# EAGLE schematic SD1015_SD1525_sheet2 (EAGLE 9.6.2)

## Sheet 1 of 9
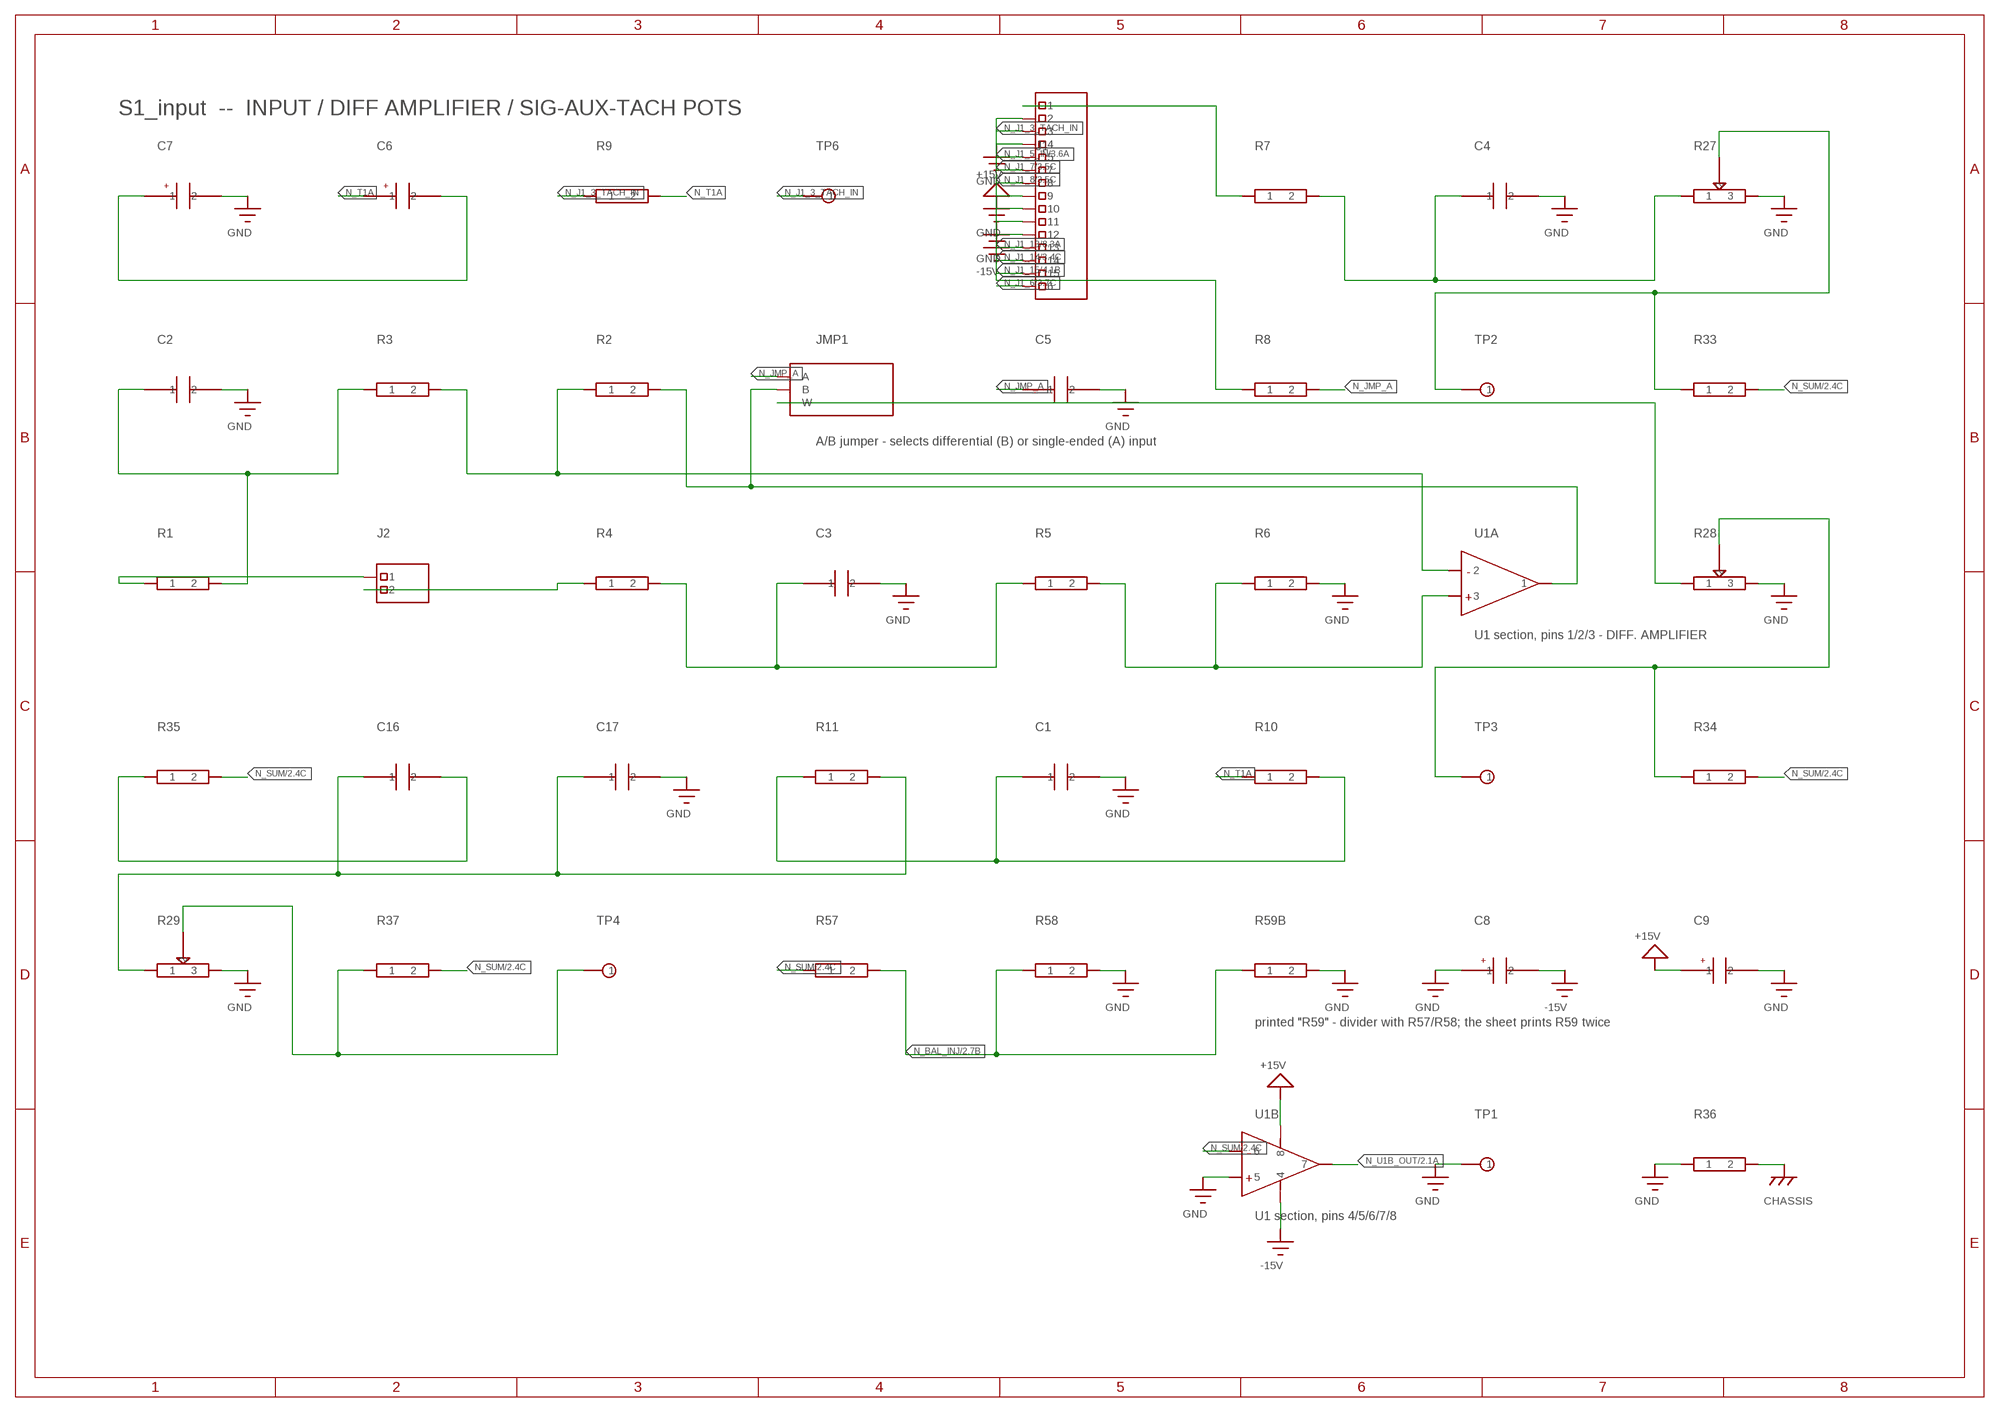
[diagram p0: schematic, sheet 1]

### Parts
C1  DS_C_1  (no package)
C2  DS_C_1  (no package)
C3  DS_C_1  (no package)
C4  DS_C_1  (no package)
C5  DS_C_1  (no package)
C6  DS_CPOL_1  (no package)
C7  DS_CPOL_1  (no package)
C8  DS_CPOL_1  (no package)
C9  DS_CPOL_1  (no package)
C16  DS_C_1  (no package)
C17  DS_C_1  (no package)
J1  DS_CONN_1  (no package)
J2  DS_CONN_2  (no package)
JMP1  A/B jumper - selects differential (B) or single-ended (A) input  DS_JUMPER_1  (no package)
R1  DS_R_1  (no package)
R2  DS_R_1  (no package)
R3  DS_R_1  (no package)
R4  DS_R_1  (no package)
R5  DS_R_1  (no package)
R6  DS_R_1  (no package)
R7  DS_R_1  (no package)
R8  DS_R_1  (no package)
R9  DS_R_1  (no package)
R10  DS_R_1  (no package)
R11  DS_R_1  (no package)
R27  DS_POT_1  (no package)
R28  DS_POT_1  (no package)
R29  DS_POT_1  (no package)
R33  DS_R_1  (no package)
R34  DS_R_1  (no package)
R35  DS_R_1  (no package)
R36  DS_R_1  (no package)
R37  DS_R_1  (no package)
R57  DS_R_1  (no package)
R58  DS_R_1  (no package)
R59B  printed "R59" - divider with R57/R58; the sheet prints R59 twice  DS_R_1  (no package)
TP1  DS_TP_1  (no package)
TP2  DS_TP_1  (no package)
TP3  DS_TP_1  (no package)
TP4  DS_TP_1  (no package)
TP6  DS_TP_1  (no package)
U1A  U1 section, pins 1/2/3 - DIFF. AMPLIFIER  DS_OPAMP_1  (no package)
U1B  U1 section, pins 4/5/6/7/8  DS_OPAMP_2  (no package)

### Nets
CHASSIS: R36.2 ; supply symbol labelled SUPPLY_CHASSIS ; also sheet 9
GND: C1.2 C2.2 C3.2 C4.2 C5.2 C7.2 C8.1 C9.2 C17.2 J1.4 J1.9 J1.11 R6.2 R27.3 R28.3 R29.3 R36.1 R58.2 R59B.2 TP1.1 U1B.5 ; supply symbol labelled SUPPLY_GND ; also sheet 2,3,4,5,6,7,8
N15: C8.2 J1.12 U1B.4 ; supply symbol labelled SUPPLY_N15 ; also sheet 2,3,6,8
N_AUX: R27.2 R33.1 TP2.1
N_AUX_IN: C4.1 R7.2 R27.1
N_BAL_INJ: R57.2 R58.1 R59B.1 ; also sheet 2
N_C6_C7_MID: C6.2 C7.1
N_CT: C16.2 R35.1
N_DIFFOUT: JMP1.B R2.2 U1A.1
N_IN1: C2.1 R1.2 R3.1
N_IN2: C3.1 R4.2 R5.1
N_J1_1: J1.1 R7.1
N_J1_2: J1.2 R8.1
N_J1_3_TACH_IN: J1.3 R9.1 TP6.1
N_J1_5_IN: J1.5 ; also sheet 3
N_J1_6: J1.6 ; also sheet 3
N_J1_7: J1.7 ; also sheet 3
N_J1_8: J1.8 ; also sheet 3
N_J1_13: J1.13 ; also sheet 8
N_J1_14: J1.14 ; also sheet 3,4
N_J1_15: J1.15 ; also sheet 4
N_J2_1: J2.1 R1.1
N_J2_2: J2.2 R4.1
N_JMP_A: C5.1 JMP1.A R8.2
N_SIG: R28.2 R34.1 TP3.1
N_SIGTOP: JMP1.W R28.1
N_SUM: R33.2 R34.2 R35.2 R37.2 R57.1 U1B.6 ; also sheet 2
N_T1A: C6.1 R9.2 R10.1
N_T2A: C1.1 R10.2 R11.1
N_TACH: C16.1 C17.1 R11.2 R29.1
N_TACH_W: R29.2 R37.1 TP4.1
N_U1A_INV: R2.1 R3.2 U1A.2
N_U1A_NONINV: R5.2 R6.1 U1A.3
N_U1B_OUT: U1B.7 ; also sheet 2
P15: C9.1 J1.10 U1B.8 ; supply symbol labelled SUPPLY_P15 ; also sheet 2,3,4,5,6,7,8

### Notes on the sheet
- S1_input  --  INPUT / DIFF AMPLIFIER / SIG-AUX-TACH POTS

## Sheet 2 of 9
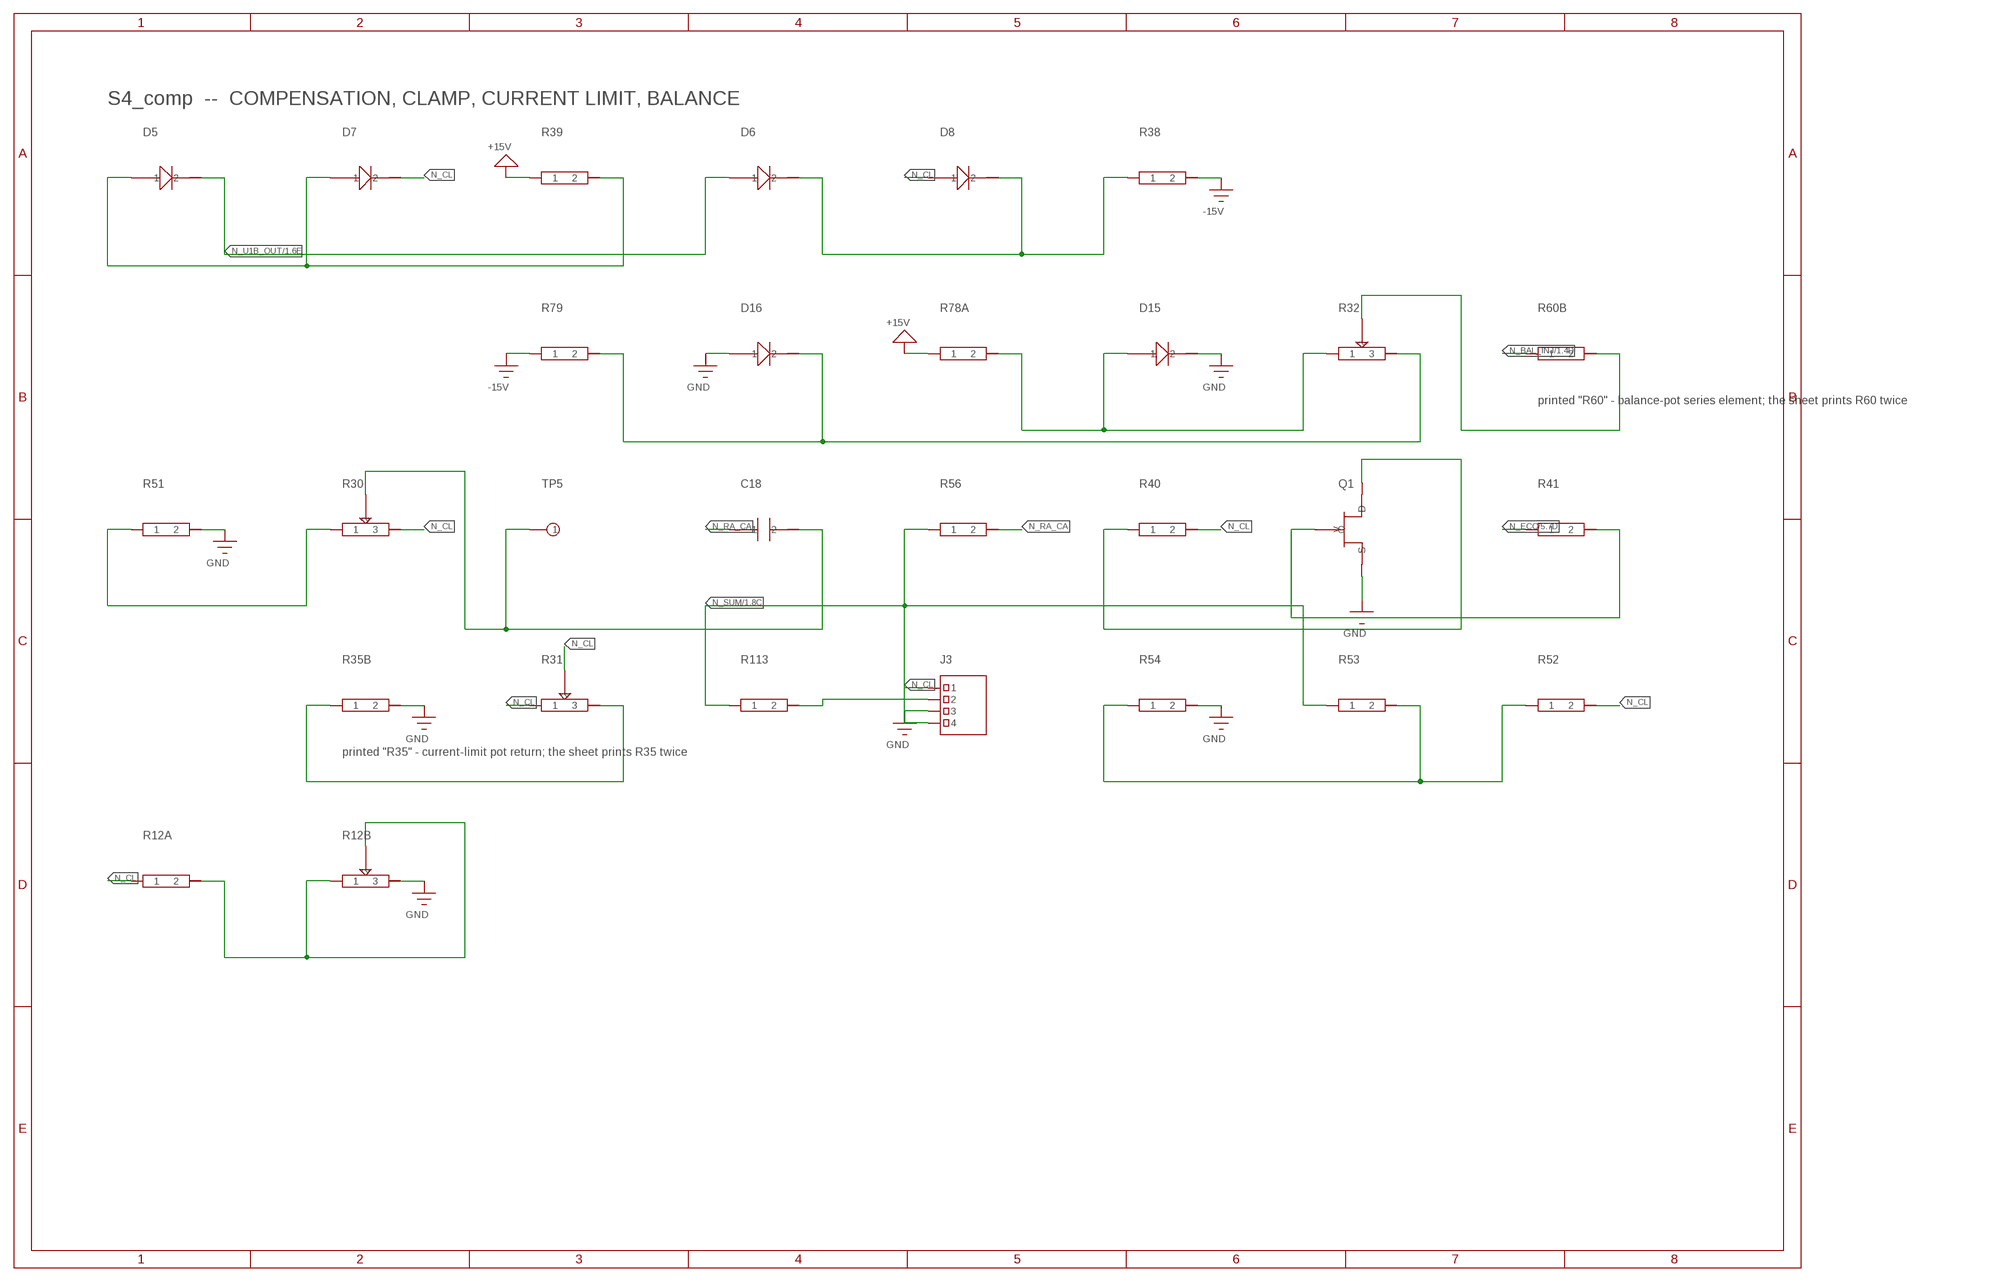
[diagram p1: schematic, sheet 2]

### Parts
C18  DS_C_1  (no package)
D5  DS_D_1  (no package)
D6  DS_D_1  (no package)
D7  DS_D_1  (no package)
D8  DS_D_1  (no package)
D15  DS_D_1  (no package)
D16  DS_D_1  (no package)
J3  DS_CONN_3  (no package)
Q1  DS_JFET_1  (no package)
R12A  DS_R_1  (no package)
R12B  DS_POT_2  (no package)
R30  DS_POT_3  (no package)
R31  DS_POT_1  (no package)
R32  DS_POT_3  (no package)
R35B  printed "R35" - current-limit pot return; the sheet prints R35 twice  DS_R_1  (no package)
R38  DS_R_1  (no package)
R39  DS_R_1  (no package)
R40  DS_R_1  (no package)
R41  DS_R_1  (no package)
R51  DS_R_1  (no package)
R52  DS_R_1  (no package)
R53  DS_R_1  (no package)
R54  DS_R_1  (no package)
R56  DS_R_1  (no package)
R60B  printed "R60" - balance-pot series element; the sheet prints R60 twice  DS_R_1  (no package)
R78A  DS_R_1  (no package)
R79  DS_R_1  (no package)
R113  DS_R_1  (no package)
TP5  DS_TP_1  (no package)

### Nets
GND: D15.2 D16.1 J3.3 Q1.S R12B.3 R35B.2 R51.2 R54.2 ; supply symbol labelled SUPPLY_GND ; also sheet 1,3,4,5,6,7,8
N15: R38.2 R79.1 ; supply symbol labelled SUPPLY_N15 ; also sheet 1,3,6,8
N_BAL_INJ: R60B.1 ; also sheet 1
N_BAL_N: D16.2 R32.3 R79.2
N_BAL_P: D15.1 R32.1 R78A.2
N_BAL_W: R32.2 R60B.2
N_CL: D7.2 D8.1 J3.1 R12A.1 R30.3 R31.1 R31.2 R40.2 R52.2
N_CLAMP_BOT: D6.2 D8.2 R38.1
N_CLAMP_TOP: D5.1 D7.1 R39.2
N_COMP_W: C18.2 R30.2 TP5.1
N_ECC: R41.1 ; also sheet 5,7
N_FB_DIV: R52.1 R53.2 R54.1
N_ILIM_BOT: R31.3 R35B.1
N_J3_2: J3.2 R113.2
N_PEAK_I: R12A.2 R12B.1 R12B.2
N_Q1_D: Q1.D R40.1
N_Q1_G: Q1.G R41.2
N_R30_TOP: R30.1 R51.1
N_RA_CA: C18.1 R56.2
N_SUM: J3.4 R53.1 R56.1 R113.1 ; also sheet 1
N_U1B_OUT: D5.2 D6.1 ; also sheet 1
P15: R39.1 R78A.1 ; supply symbol labelled SUPPLY_P15 ; also sheet 1,3,4,5,6,7,8

### Notes on the sheet
- S4_comp  --  COMPENSATION, CLAMP, CURRENT LIMIT, BALANCE

## Sheet 3 of 9
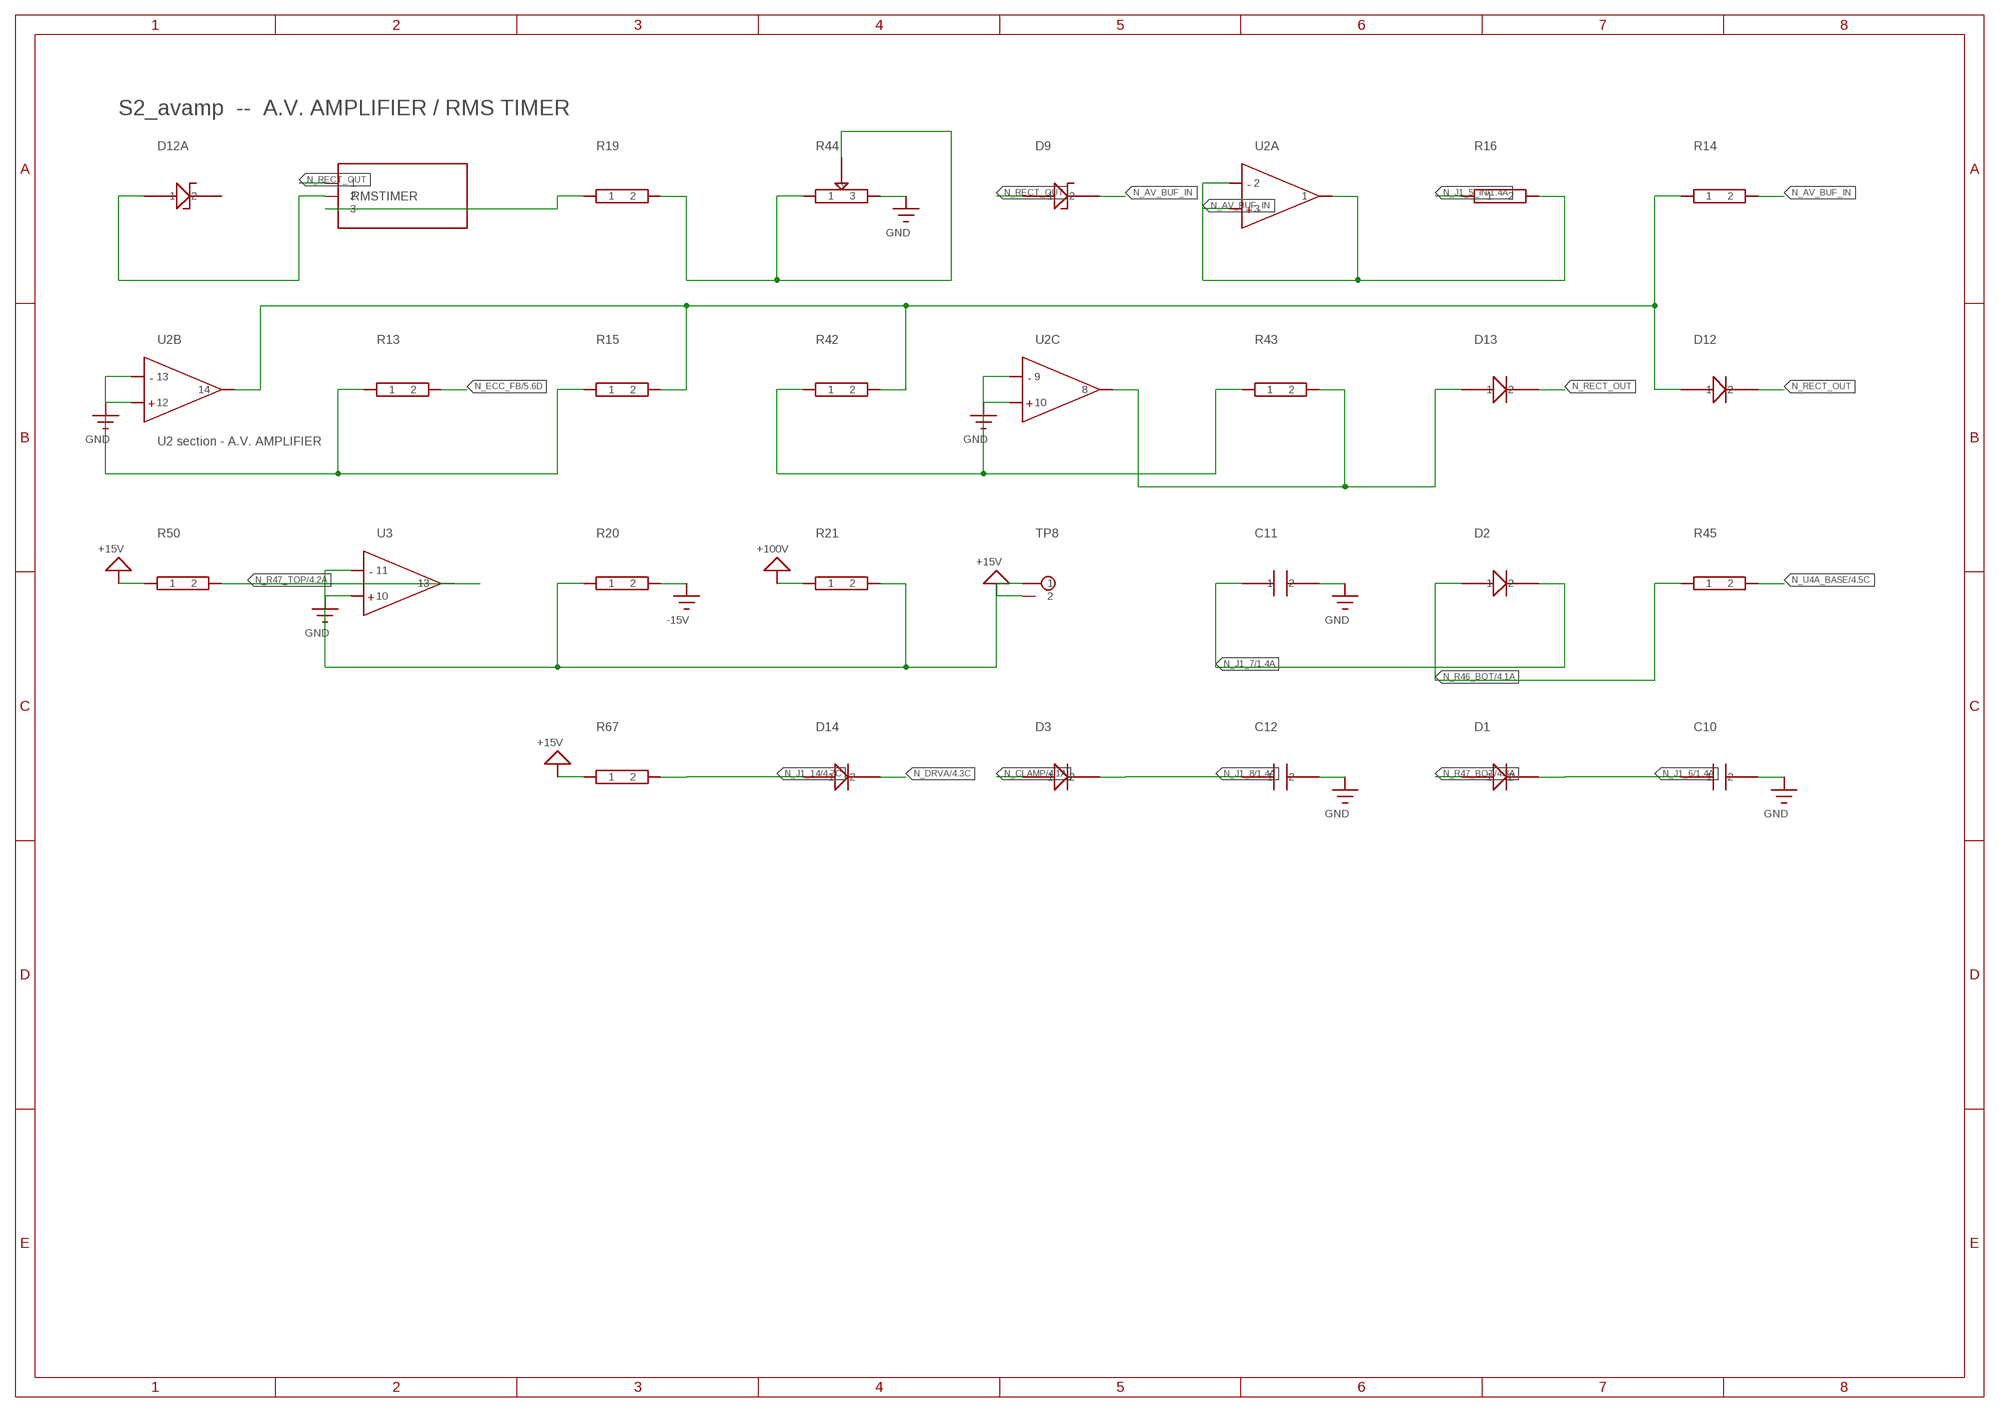
[diagram p2: schematic, sheet 3]

### Parts
C10  DS_C_1  (no package)
C11  DS_C_1  (no package)
C12  DS_C_1  (no package)
D1  DS_D_1  (no package)
D2  DS_D_1  (no package)
D3  DS_D_1  (no package)
D9  DS_ZENER_1  (no package)
D12  DS_D_1  (no package)
D12A  DS_ZENER_1  (no package)
D13  DS_D_1  (no package)
D14  DS_D_1  (no package)
R13  DS_R_1  (no package)
R14  DS_R_1  (no package)
R15  DS_R_1  (no package)
R16  DS_R_1  (no package)
R19  DS_R_1  (no package)
R20  DS_R_1  (no package)
R21  DS_R_1  (no package)
R42  DS_R_1  (no package)
R43  DS_R_1  (no package)
R44  DS_POT_2  (no package)
R45  DS_R_1  (no package)
R50  DS_R_1  (no package)
R67  DS_R_1  (no package)
RMSTIMER  DS_BLOCK_1  (no package)
TP8  DS_TP_2  (no package)
U2A  DS_OPAMP_1  (no package)
U2B  U2 section - A.V. AMPLIFIER  DS_OPAMP_3  (no package)
U2C  DS_OPAMP_4  (no package)
U3  DS_COMP_1  (no package)

### Nets
GND: C10.2 C11.2 C12.2 R44.3 U2B.12 U2C.10 U3.10 ; supply symbol labelled SUPPLY_GND ; also sheet 1,2,4,5,6,7,8
N15: R20.2 ; supply symbol labelled SUPPLY_N15 ; also sheet 1,2,6,8
N_AV_BUF_IN: D9.2 R14.2 U2A.3
N_AV_OUT: D12.1 R14.1 R15.2 R42.2 U2B.14
N_CLAMP: D3.1 ; also sheet 4
N_DRVA: D14.2 ; also sheet 4
N_ECC_FB: R13.2 ; also sheet 5
N_J1_5_IN: R16.1 ; also sheet 1
N_J1_6: C10.1 D1.2 ; also sheet 1
N_J1_7: C11.1 D2.2 ; also sheet 1
N_J1_8: C12.1 D3.2 ; also sheet 1
N_J1_14: D14.1 R67.2 ; also sheet 1,4
N_R46_BOT: D2.1 R45.1 ; also sheet 4
N_R47_BOT: D1.1 ; also sheet 4
N_R47_TOP: R50.2 U3.13 ; also sheet 4
N_RECT_OUT: D9.1 D12.2 D13.2 RMSTIMER.1
N_RMS_LEVEL: R19.2 R44.1 R44.2
N_RMS_OUT: R19.1 RMSTIMER.3
N_RMS_TOP: D12A.1 RMSTIMER.2
N_U2A_OUT: R16.2 U2A.1 U2A.2
N_U2B_INV: R13.1 R15.1 U2B.13
N_U2C_INV: R42.1 R43.1 U2C.9
N_U2C_OUT: D13.1 R43.2 U2C.8
N_U3_INV: R20.1 R21.2 TP8.1 U3.11
N_U4A_BASE: R45.2 ; also sheet 4
P15: R50.1 R67.1 TP8.2 ; supply symbol labelled SUPPLY_P15 ; also sheet 1,2,4,5,6,7,8
P100: R21.1 ; supply symbol labelled SUPPLY_P100 ; also sheet 6
Unconnected: D12A.2

### Notes on the sheet
- S2_avamp  --  A.V. AMPLIFIER / RMS TIMER

## Sheet 4 of 9
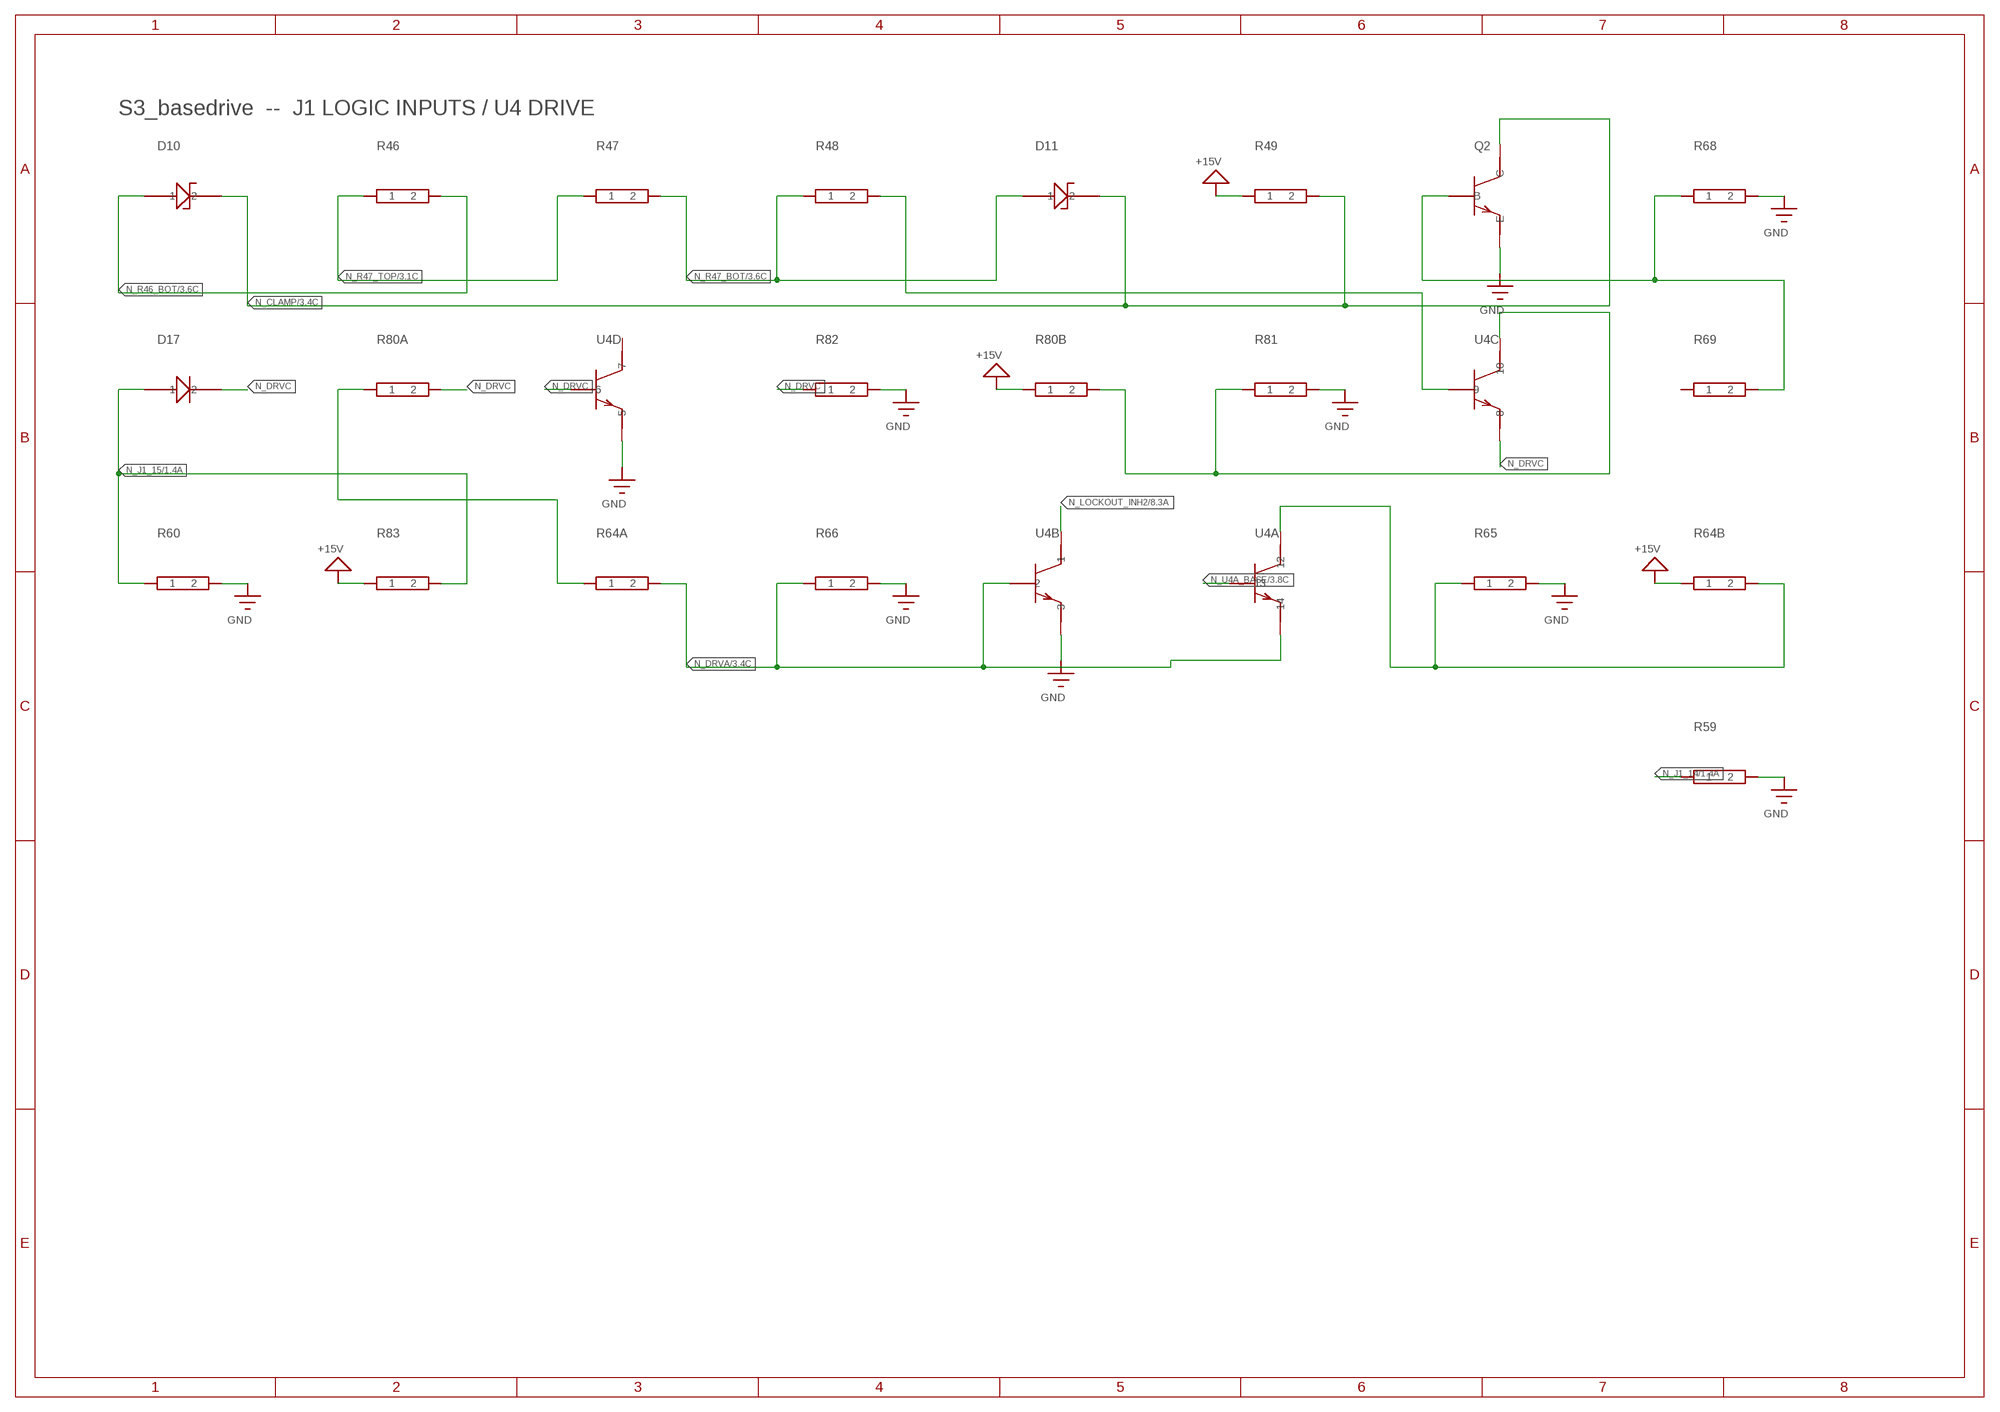
[diagram p3: schematic, sheet 4]

### Parts
D10  DS_ZENER_1  (no package)
D11  DS_ZENER_1  (no package)
D17  DS_D_1  (no package)
Q2  DS_NPN_1  (no package)
R46  DS_R_1  (no package)
R47  DS_R_1  (no package)
R48  DS_R_1  (no package)
R49  DS_R_1  (no package)
R59  DS_R_1  (no package)
R60  DS_R_1  (no package)
R64A  DS_R_1  (no package)
R64B  DS_R_1  (no package)
R65  DS_R_1  (no package)
R66  DS_R_1  (no package)
R68  DS_R_1  (no package)
R69  DS_R_1  (no package)
R80A  DS_R_1  (no package)
R80B  DS_R_1  (no package)
R81  DS_R_1  (no package)
R82  DS_R_1  (no package)
R83  DS_R_1  (no package)
U4A  DS_NPN_2  (no package)
U4B  DS_NPN_3  (no package)
U4C  DS_NPN_4  (no package)
U4D  DS_NPN_5  (no package)

### Nets
GND: Q2.E R59.2 R60.2 R65.2 R66.2 R68.2 R81.2 R82.2 U4B.3 U4D.5 ; supply symbol labelled SUPPLY_GND ; also sheet 1,2,3,5,6,7,8
N_CLAMP: D10.2 D11.2 Q2.C R49.2 ; also sheet 3
N_DRVA: R64A.2 R66.1 U4A.14 U4B.2 ; also sheet 3
N_DRVC: D17.2 R80A.2 R82.1 U4C.8 U4D.6
N_J1_14: R59.1 ; also sheet 1,3
N_J1_15: D17.1 R60.1 R83.2 ; also sheet 1
N_LOCKOUT_INH2: U4B.1 ; also sheet 8
N_Q2_BASE: Q2.B R68.1 R69.2
N_R46_BOT: D10.1 R46.2 ; also sheet 3
N_R47_BOT: D11.1 R47.2 R48.1 ; also sheet 3
N_R47_TOP: R46.1 R47.1 ; also sheet 3
N_R64A_R80A_TOP: R64A.1 R80A.1
N_U4A_BASE: U4A.13 ; also sheet 3
N_U4A_COL: R64B.2 R65.1 U4A.12
N_U4C_BASE: R48.2 U4C.9
N_U4C_COL: R80B.2 R81.1 U4C.10
P15: R49.1 R64B.1 R80B.1 R83.1 ; supply symbol labelled SUPPLY_P15 ; also sheet 1,2,3,5,6,7,8
Unconnected: R69.1 U4D.7

### Notes on the sheet
- S3_basedrive  --  J1 LOGIC INPUTS / U4 DRIVE

## Sheet 5 of 9
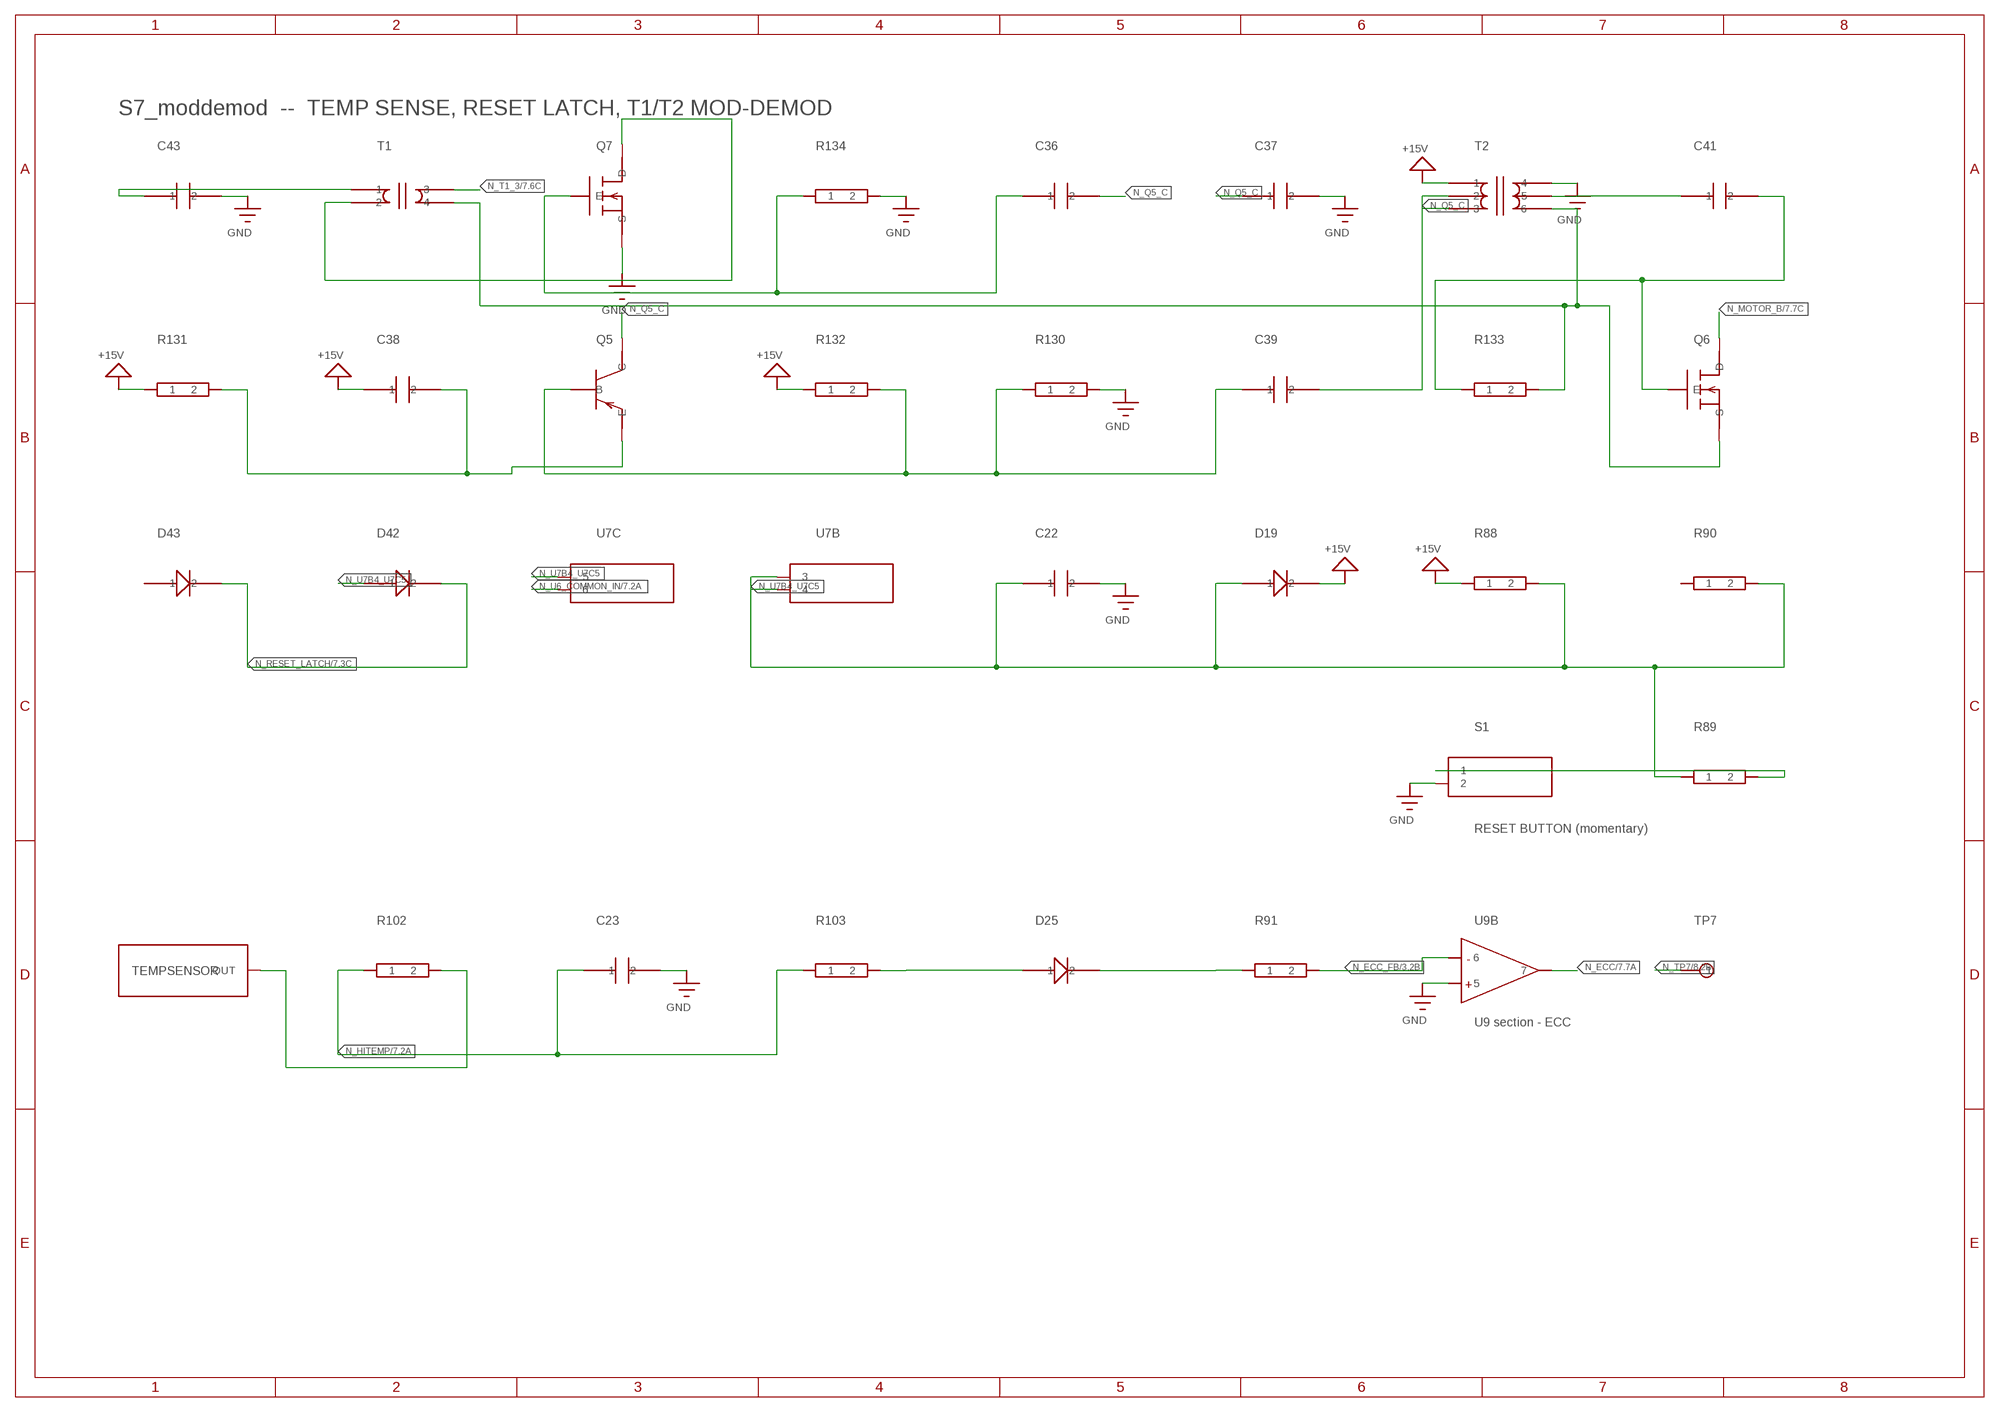
[diagram p4: schematic, sheet 5]

### Parts
C22  DS_C_1  (no package)
C23  DS_C_1  (no package)
C36  DS_C_1  (no package)
C37  DS_C_1  (no package)
C38  DS_C_1  (no package)
C39  DS_C_1  (no package)
C41  DS_C_1  (no package)
C43  DS_C_1  (no package)
D19  DS_D_1  (no package)
D25  DS_D_1  (no package)
D42  DS_D_1  (no package)
D43  DS_D_1  (no package)
Q5  DS_PNP_1  (no package)
Q6  DS_NMOS_1  (no package)
Q7  DS_NMOS_1  (no package)
R88  DS_R_1  (no package)
R89  DS_R_1  (no package)
R90  DS_R_1  (no package)
R91  DS_R_1  (no package)
R102  DS_R_1  (no package)
R103  DS_R_1  (no package)
R130  DS_R_1  (no package)
R131  DS_R_1  (no package)
R132  DS_R_1  (no package)
R133  DS_R_1  (no package)
R134  DS_R_1  (no package)
S1  RESET BUTTON (momentary)  DS_JUMPER_2  (no package)
T1  DS_XFMR_1  (no package)
T2  DS_XFMR_2  (no package)
TEMPSENSOR  DS_BLOCK_2  (no package)
TP7  DS_TP_1  (no package)
U7B  DS_IC_5  (no package)
U7C  DS_IC_6  (no package)
U9B  U9 section - ECC  DS_OPAMP_5  (no package)

### Nets
GND: C22.2 C23.2 C37.2 C43.2 Q7.S R130.2 R134.2 S1.2 T2.4 U9B.5 ; supply symbol labelled SUPPLY_GND ; also sheet 1,2,3,4,6,7,8
N_D25K: D25.2 R91.1
N_ECC: U9B.7 ; also sheet 2,7
N_ECC_FB: R91.2 U9B.6 ; also sheet 3
N_HITEMP: C23.1 R102.1 R103.1 ; also sheet 7
N_MODIN: C43.1 T1.1
N_MOTOR_B: Q6.D ; also sheet 7,9
N_Q5_B: C39.1 Q5.B R130.1 R132.2
N_Q5_C: C36.2 C37.1 Q5.C T2.3
N_Q5_E: C38.2 Q5.E R131.2
N_Q6_GATE: C41.2 Q6.E R133.1
N_Q7_GATE: C36.1 Q7.E R134.1
N_R103_D25: D25.1 R103.2
N_RESET_LATCH: D42.2 D43.2 ; also sheet 7
N_S1_R89: R89.2 S1.1
N_T1_2: Q7.D T1.2
N_T1_3: T1.3 ; also sheet 7
N_T1_4: Q6.S R133.2 T1.4 T2.6
N_T2_2: C39.2 T2.2
N_T2_5: C41.1 T2.5
N_TEMPSENS_OUT: R102.2 TEMPSENSOR.OUT
N_TEMPTRIP: C22.1 D19.1 R88.2 R89.1 R90.2 U7B.3
N_TP7: TP7.1 ; also sheet 8
N_U6_COMMON_IN: U7C.6 ; also sheet 7
N_U7B4_U7C5: D42.1 U7B.4 U7C.5
P15: C38.1 D19.2 R88.1 R131.1 R132.1 T2.1 ; supply symbol labelled SUPPLY_P15 ; also sheet 1,2,3,4,6,7,8
Unconnected: D43.1 R90.1

### Notes on the sheet
- S7_moddemod  --  TEMP SENSE, RESET LATCH, T1/T2 MOD-DEMOD

## Sheet 6 of 9
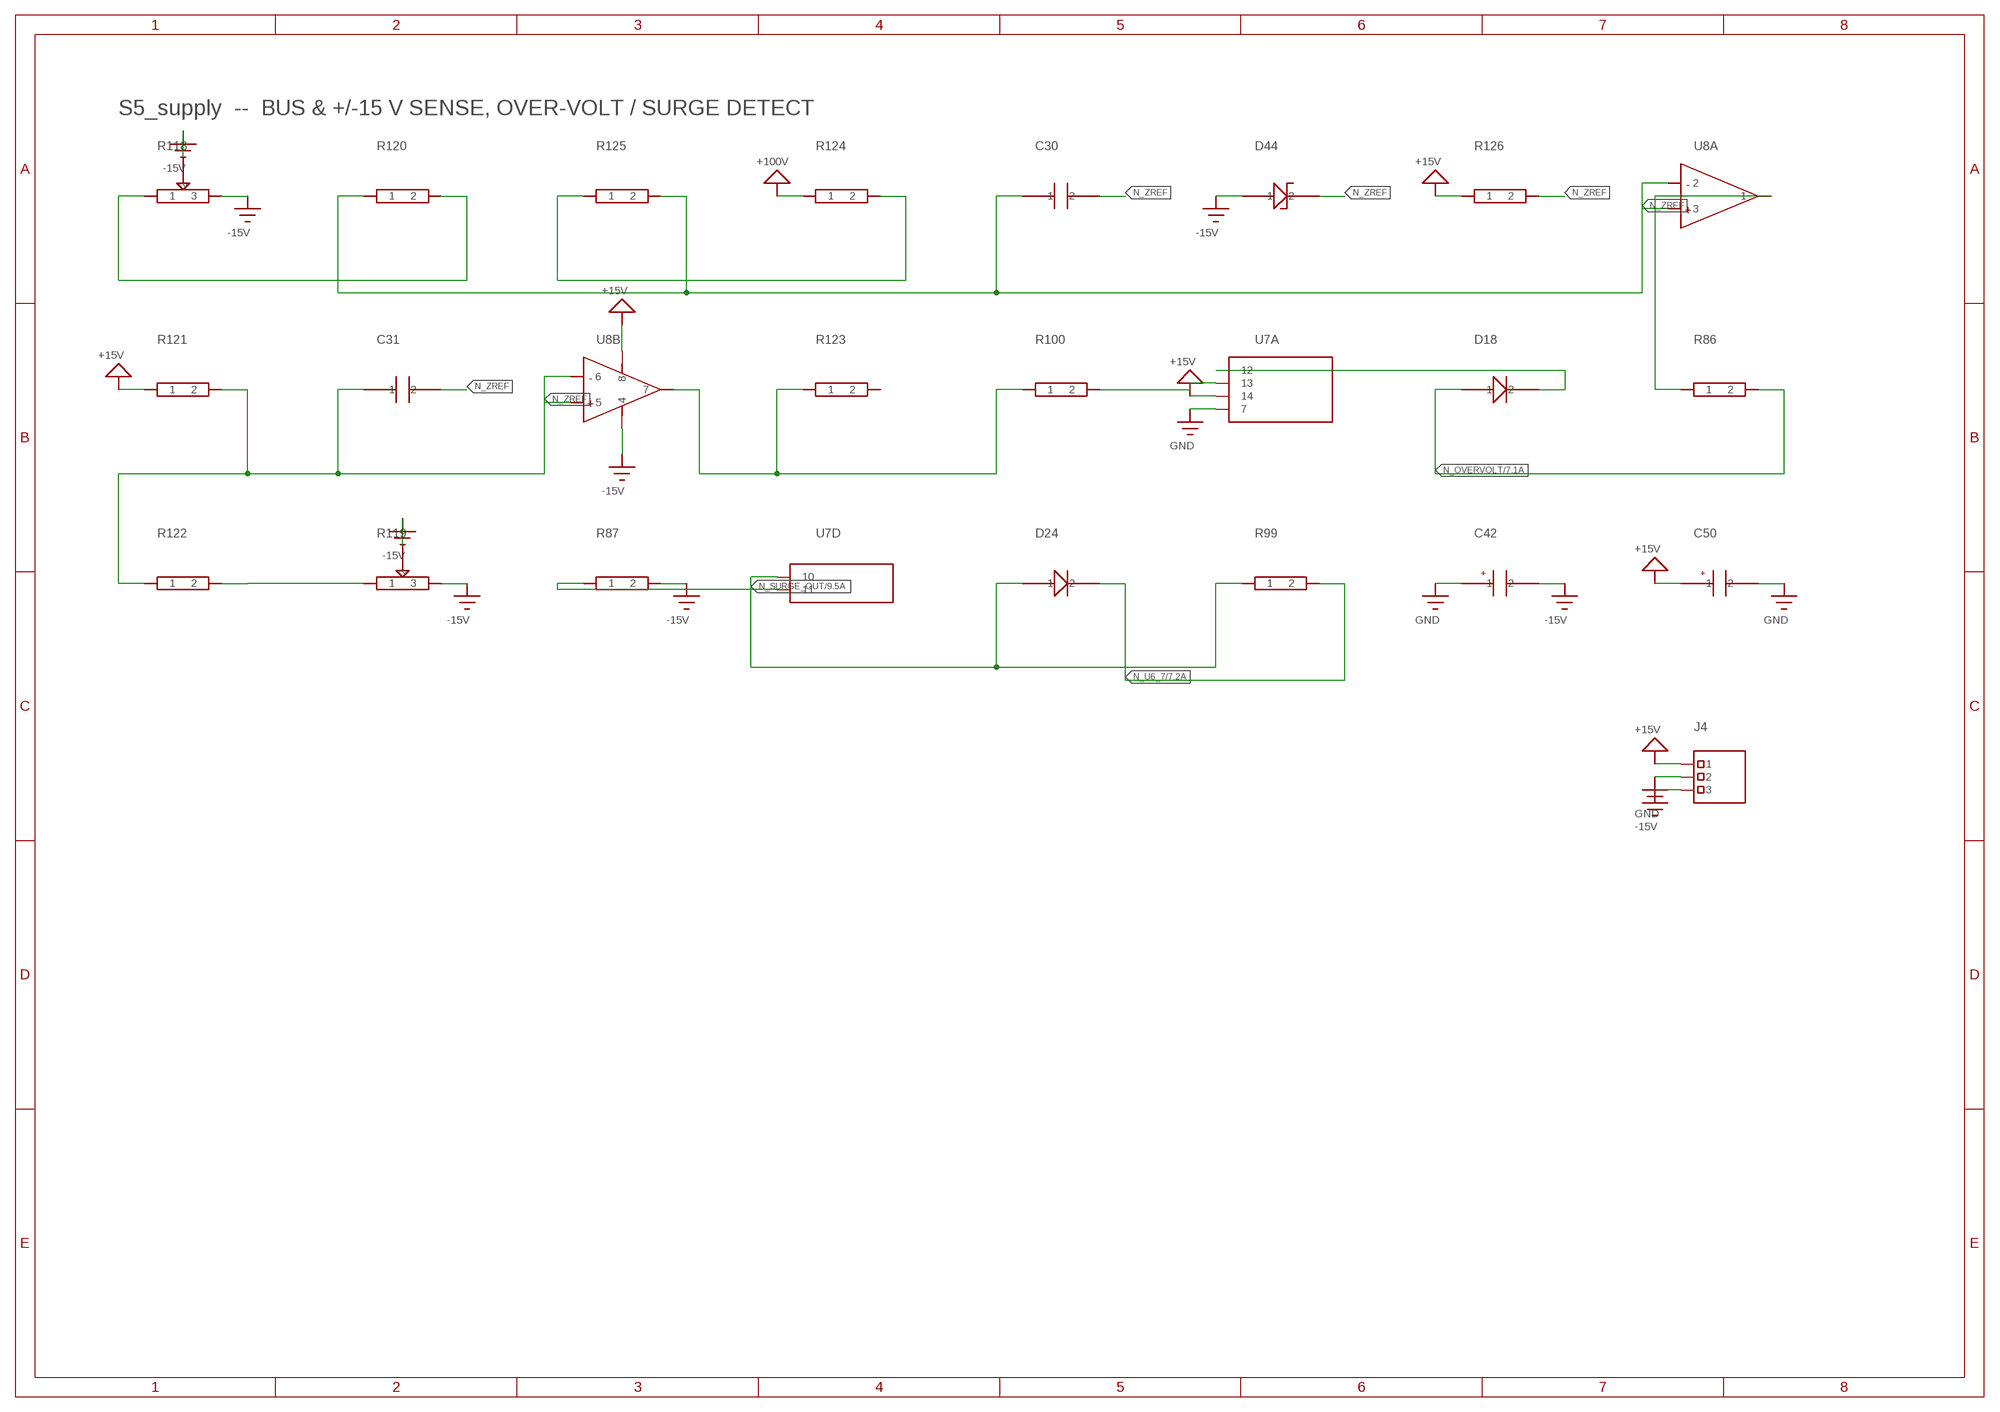
[diagram p5: schematic, sheet 6]

### Parts
C30  DS_C_1  (no package)
C31  DS_C_1  (no package)
C42  DS_CPOL_1  (no package)
C50  DS_CPOL_1  (no package)
D18  DS_D_1  (no package)
D24  DS_D_1  (no package)
D44  DS_ZENER_1  (no package)
J4  DS_CONN_4  (no package)
R86  DS_R_1  (no package)
R87  DS_R_1  (no package)
R99  DS_R_1  (no package)
R100  DS_R_1  (no package)
R118  DS_POT_4  (no package)
R119  DS_POT_4  (no package)
R120  DS_R_1  (no package)
R121  DS_R_1  (no package)
R122  DS_R_1  (no package)
R123  DS_R_1  (no package)
R124  DS_R_1  (no package)
R125  DS_R_1  (no package)
R126  DS_R_1  (no package)
U7A  DS_IC_1  (no package)
U7D  DS_IC_2  (no package)
U8A  DS_OPAMP_1  (no package)
U8B  DS_OPAMP_2  (no package)

### Nets
GND: C42.1 C50.2 J4.2 U7A.7 ; supply symbol labelled SUPPLY_GND ; also sheet 1,2,3,4,5,7,8
N15: C42.2 D44.1 J4.3 R87.2 R118.2 R118.3 R119.2 R119.3 U8B.4 ; supply symbol labelled SUPPLY_N15 ; also sheet 1,2,3,8
N_15VADJ: R119.1 R122.2
N_15VSENSE: C31.1 R121.2 R122.1 U8B.6
N_BUSSENSE: C30.1 R120.1 R125.2 U8A.2
N_HIBUSADJ: R118.1 R120.2
N_OVERVOLT: D18.1 R86.2 ; also sheet 7
N_R124_R125: R124.2 R125.1
N_SURGE_OUT: R87.1 U7D.11 ; also sheet 9
N_U6_7: D24.2 R99.2 ; also sheet 7
N_U7A_IN: R100.2 U7A.13
N_U7A_OUT: D18.2 U7A.12
N_U7D_OUT: D24.1 R99.1 U7D.10
N_U8A_OUT: R86.1 U8A.1
N_U8B_OUT: R100.1 R123.1 U8B.7
N_ZREF: C30.2 C31.2 D44.2 R126.2 U8A.3 U8B.5
P15: C50.1 J4.1 R121.1 R126.1 U7A.14 U8B.8 ; supply symbol labelled SUPPLY_P15 ; also sheet 1,2,3,4,5,7,8
P100: R124.1 ; supply symbol labelled SUPPLY_P100 ; also sheet 3
Unconnected: R123.2

### Notes on the sheet
- S5_supply  --  BUS & +/-15 V SENSE, OVER-VOLT / SURGE DETECT

## Sheet 7 of 9
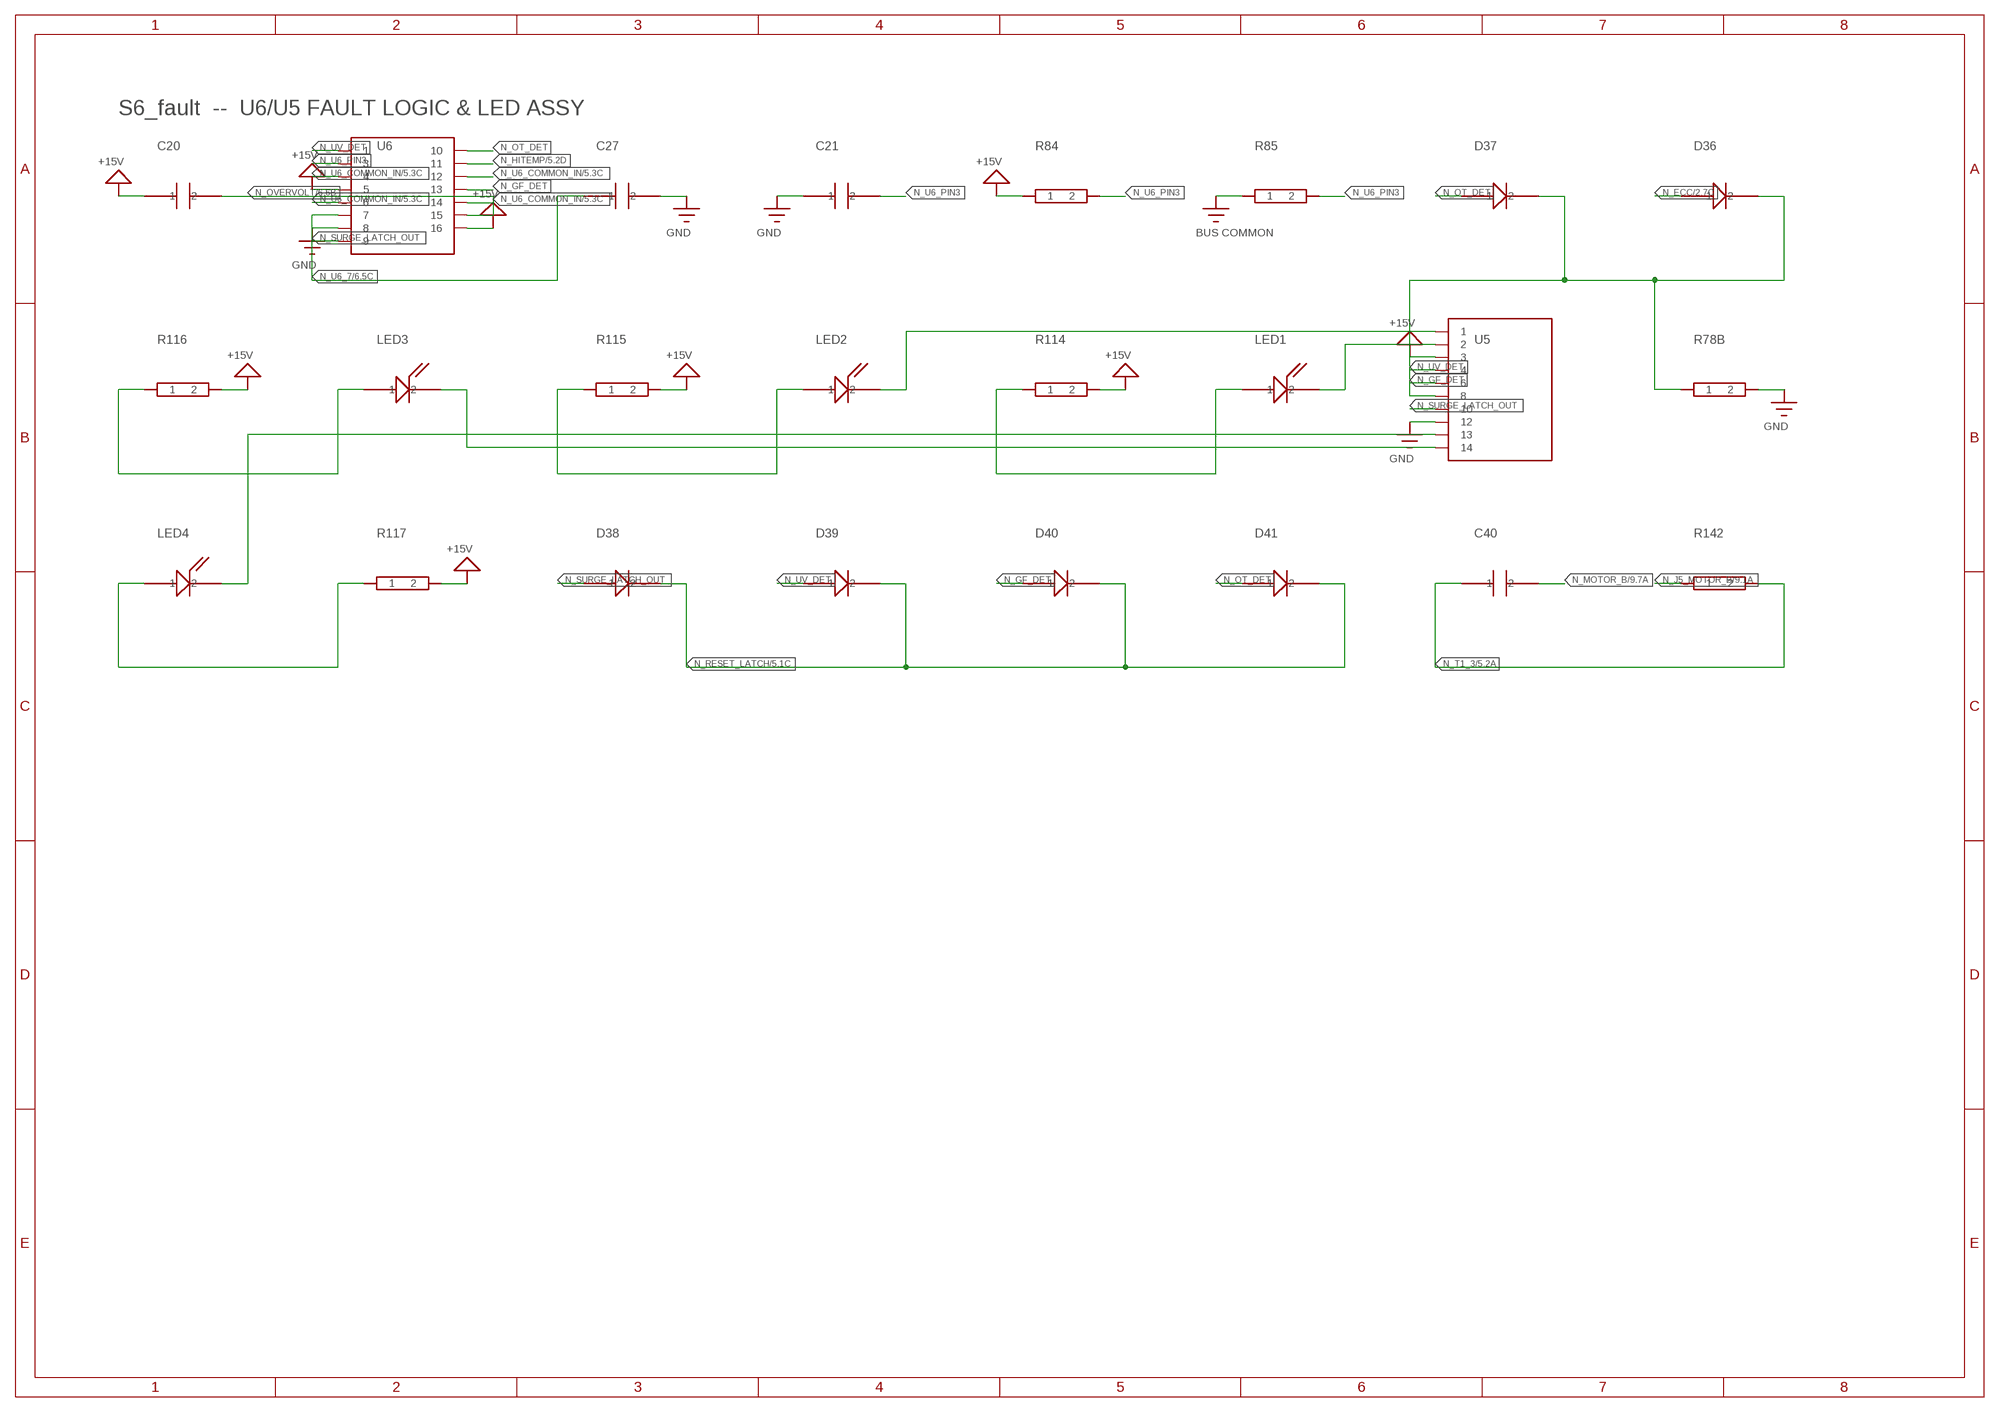
[diagram p6: schematic, sheet 7]

### Parts
C20  DS_C_1  (no package)
C21  DS_C_1  (no package)
C27  DS_C_1  (no package)
C40  DS_C_1  (no package)
D36  DS_D_1  (no package)
D37  DS_D_1  (no package)
D38  DS_D_1  (no package)
D39  DS_D_1  (no package)
D40  DS_D_1  (no package)
D41  DS_D_1  (no package)
LED1  DS_LED_1  (no package)
LED2  DS_LED_1  (no package)
LED3  DS_LED_1  (no package)
LED4  DS_LED_1  (no package)
R78B  DS_R_1  (no package)
R84  DS_R_1  (no package)
R85  DS_R_1  (no package)
R114  DS_R_1  (no package)
R115  DS_R_1  (no package)
R116  DS_R_1  (no package)
R117  DS_R_1  (no package)
R142  DS_R_1  (no package)
U5  DS_IC_4  (no package)
U6  DS_IC_3  (no package)

### Nets
BUSCOM: R85.1 ; supply symbol labelled SUPPLY_BUSCOM ; also sheet 9
GND: C21.1 C27.2 R78B.2 U5.12 U6.8 ; supply symbol labelled SUPPLY_GND ; also sheet 1,2,3,4,5,6,8
N_ECC: D36.1 ; also sheet 2,5
N_GF_DET: D40.1 U5.6 U6.13
N_HITEMP: U6.11 ; also sheet 5
N_J5_MOTOR_B: R142.1 ; also sheet 9
N_LED_GF: LED2.2 U5.1
N_LED_GF_A: LED2.1 R115.1
N_LED_OT: LED3.2 U5.14
N_LED_OT_A: LED3.1 R116.1
N_LED_SURGE: LED4.2 U5.13
N_LED_SURGE_A: LED4.1 R117.1
N_LED_UV: LED1.2 U5.2
N_LED_UV_A: LED1.1 R114.1
N_MOTOR_B: C40.2 ; also sheet 5,9
N_OT_DET: D37.1 D41.1 U6.10
N_OT_LATCH_OUT: D36.2 D37.2 R78B.1 U5.8
N_OVERVOLT: C20.2 U6.15 ; also sheet 6
N_RESET_LATCH: D38.2 D39.2 D40.2 D41.2 ; also sheet 5
N_SURGE_LATCH_OUT: D38.1 U5.10 U6.9
N_T1_3: C40.1 R142.2 ; also sheet 5
N_U6_7: C27.1 U6.7 ; also sheet 6
N_U6_COMMON_IN: U6.4 U6.6 U6.12 U6.14 ; also sheet 5
N_U6_PIN3: C21.2 R84.2 R85.2 U6.3
N_UV_DET: D39.1 U5.4 U6.1
P15: C20.1 R84.1 R114.2 R115.2 R116.2 R117.2 U5.3 U6.5 U6.16 ; supply symbol labelled SUPPLY_P15 ; also sheet 1,2,3,4,5,6,8

### Notes on the sheet
- S6_fault  --  U6/U5 FAULT LOGIC & LED ASSY

## Sheet 8 of 9
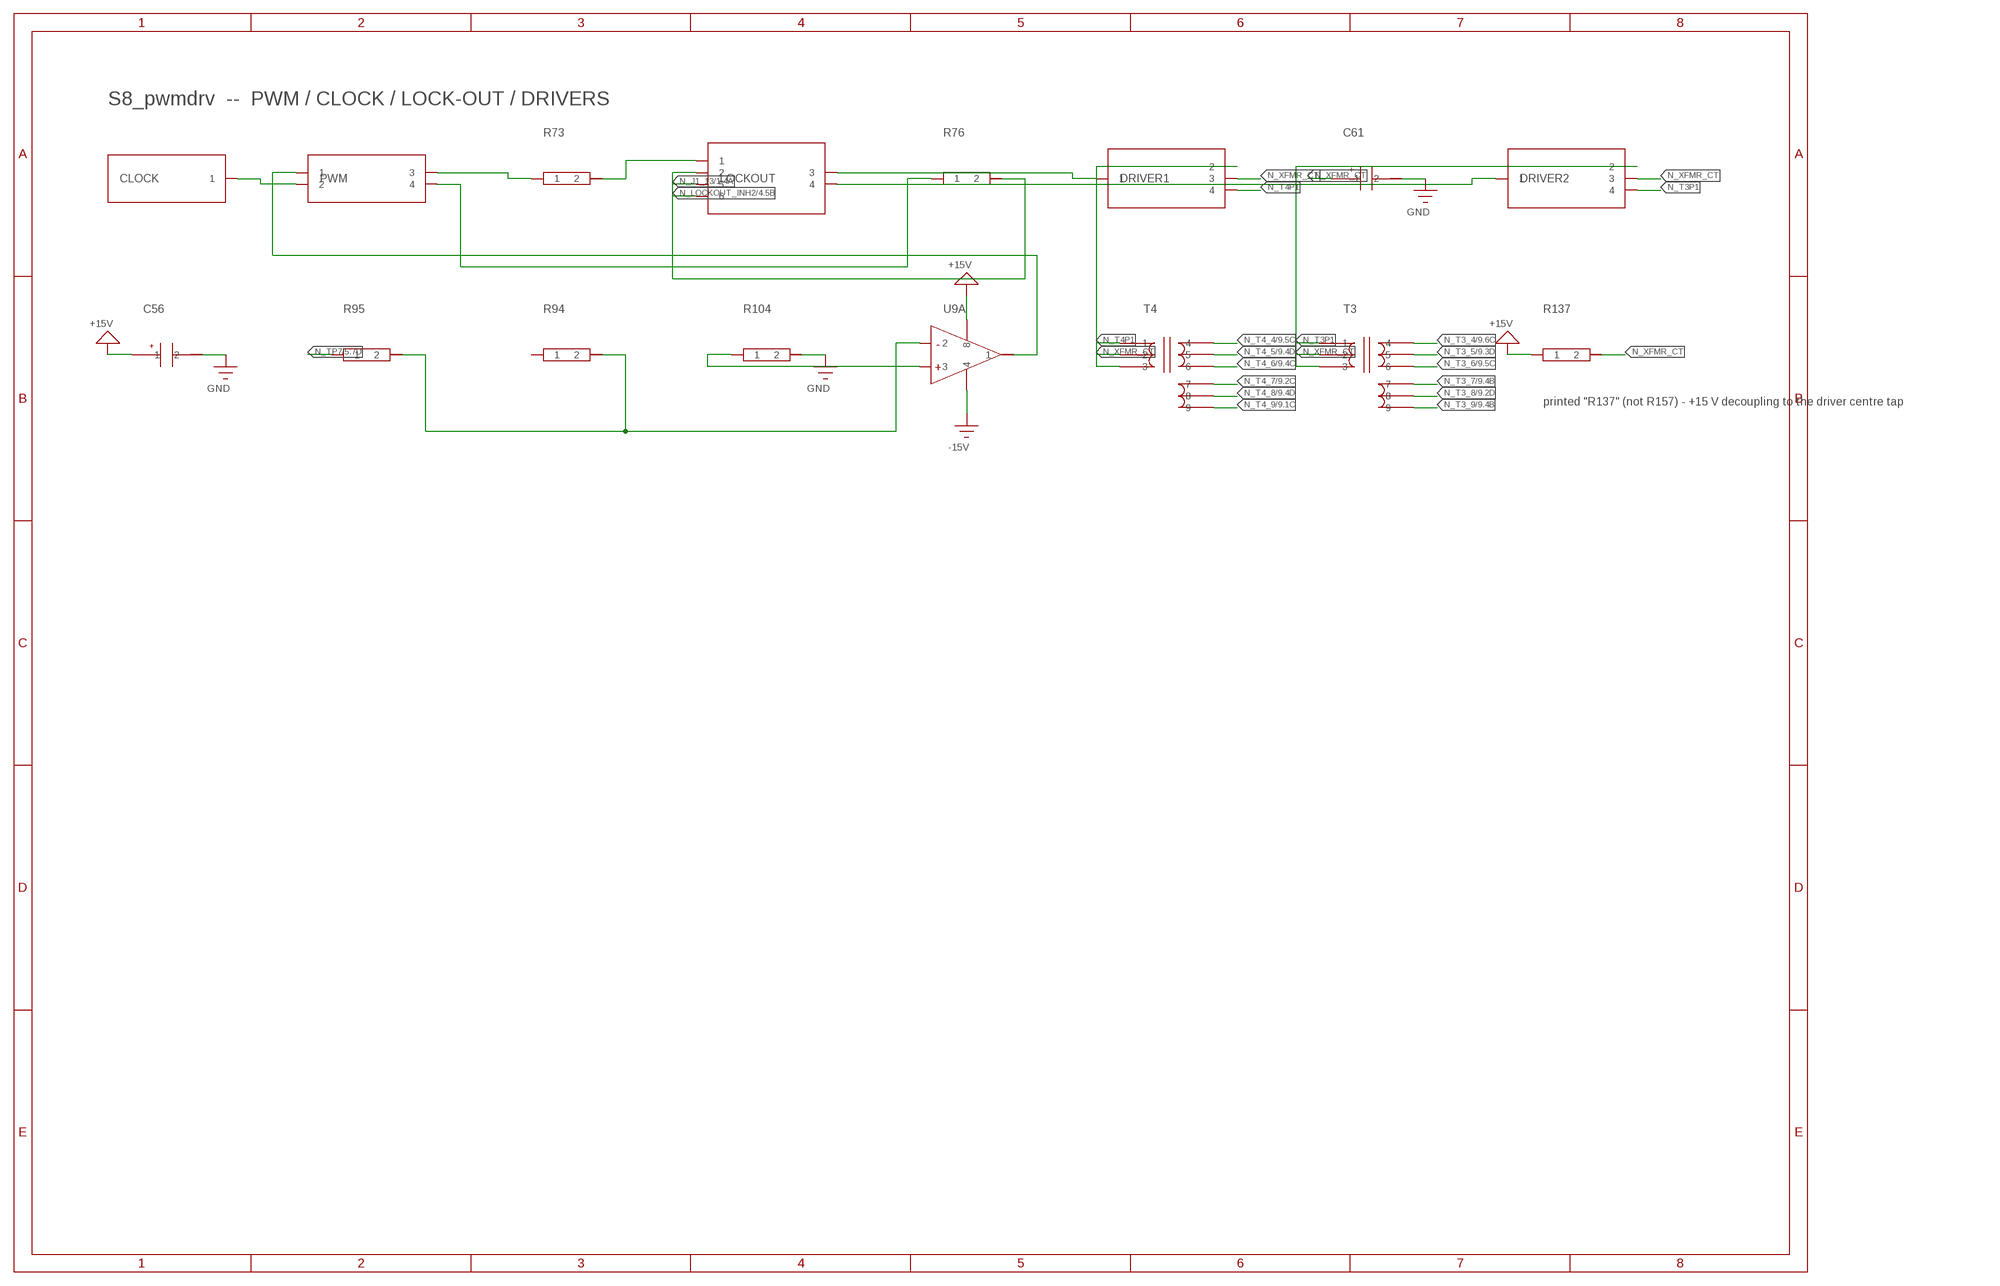
[diagram p7: schematic, sheet 8]

### Parts
C56  DS_CPOL_1  (no package)
C61  DS_CPOL_1  (no package)
CLOCK  DS_BLOCK_4  (no package)
DRIVER1  DS_BLOCK_6  (no package)
DRIVER2  DS_BLOCK_6  (no package)
LOCKOUT  DS_BLOCK_5  (no package)
PWM  DS_BLOCK_3  (no package)
R73  DS_R_1  (no package)
R76  DS_R_1  (no package)
R94  DS_R_1  (no package)
R95  DS_R_1  (no package)
R104  DS_R_1  (no package)
R137  printed "R137" (not R157) - +15 V decoupling to the driver centre tap  DS_R_1  (no package)
T3  DS_XFMR_3  (no package)
T4  DS_XFMR_3  (no package)
U9A  DS_OPAMP_6  (no package)

### Nets
GND: C56.2 C61.2 R104.2 ; supply symbol labelled SUPPLY_GND ; also sheet 1,2,3,4,5,6,7
N15: U9A.4 ; supply symbol labelled SUPPLY_N15 ; also sheet 1,2,3,6
N_CLK_OUT: CLOCK.1 PWM.2
N_J1_13: LOCKOUT.5 ; also sheet 1
N_LO_OUTA: DRIVER1.1 LOCKOUT.3
N_LO_OUTB: DRIVER2.1 LOCKOUT.4
N_LOCKOUT_INH2: LOCKOUT.6 ; also sheet 4
N_PWM_OUTA: PWM.3 R73.1
N_PWM_OUTB: PWM.4 R76.1
N_R73_LO: LOCKOUT.1 R73.2
N_R76_LO: LOCKOUT.2 R76.2
N_T3_4: T3.4 ; also sheet 9
N_T3_5: T3.5 ; also sheet 9
N_T3_6: T3.6 ; also sheet 9
N_T3_7: T3.7 ; also sheet 9
N_T3_8: T3.8 ; also sheet 9
N_T3_9: T3.9 ; also sheet 9
N_T3P1: DRIVER2.4 T3.1
N_T3P3: DRIVER2.2 T3.3
N_T4_4: T4.4 ; also sheet 9
N_T4_5: T4.5 ; also sheet 9
N_T4_6: T4.6 ; also sheet 9
N_T4_7: T4.7 ; also sheet 9
N_T4_8: T4.8 ; also sheet 9
N_T4_9: T4.9 ; also sheet 9
N_T4P1: DRIVER1.4 T4.1
N_T4P3: DRIVER1.2 T4.3
N_TP7: R95.1 ; also sheet 5
N_U9_NONINV: R104.1 U9A.3
N_U9_OUT: PWM.1 U9A.1
N_U9_SUM: R94.2 R95.2 U9A.2
N_XFMR_CT: C61.1 DRIVER1.3 DRIVER2.3 R137.2 T3.2 T4.2
P15: C56.1 R137.1 U9A.8 ; supply symbol labelled SUPPLY_P15 ; also sheet 1,2,3,4,5,6,7
Unconnected: R94.1

### Notes on the sheet
- S8_pwmdrv  --  PWM / CLOCK / LOCK-OUT / DRIVERS

## Sheet 9 of 9
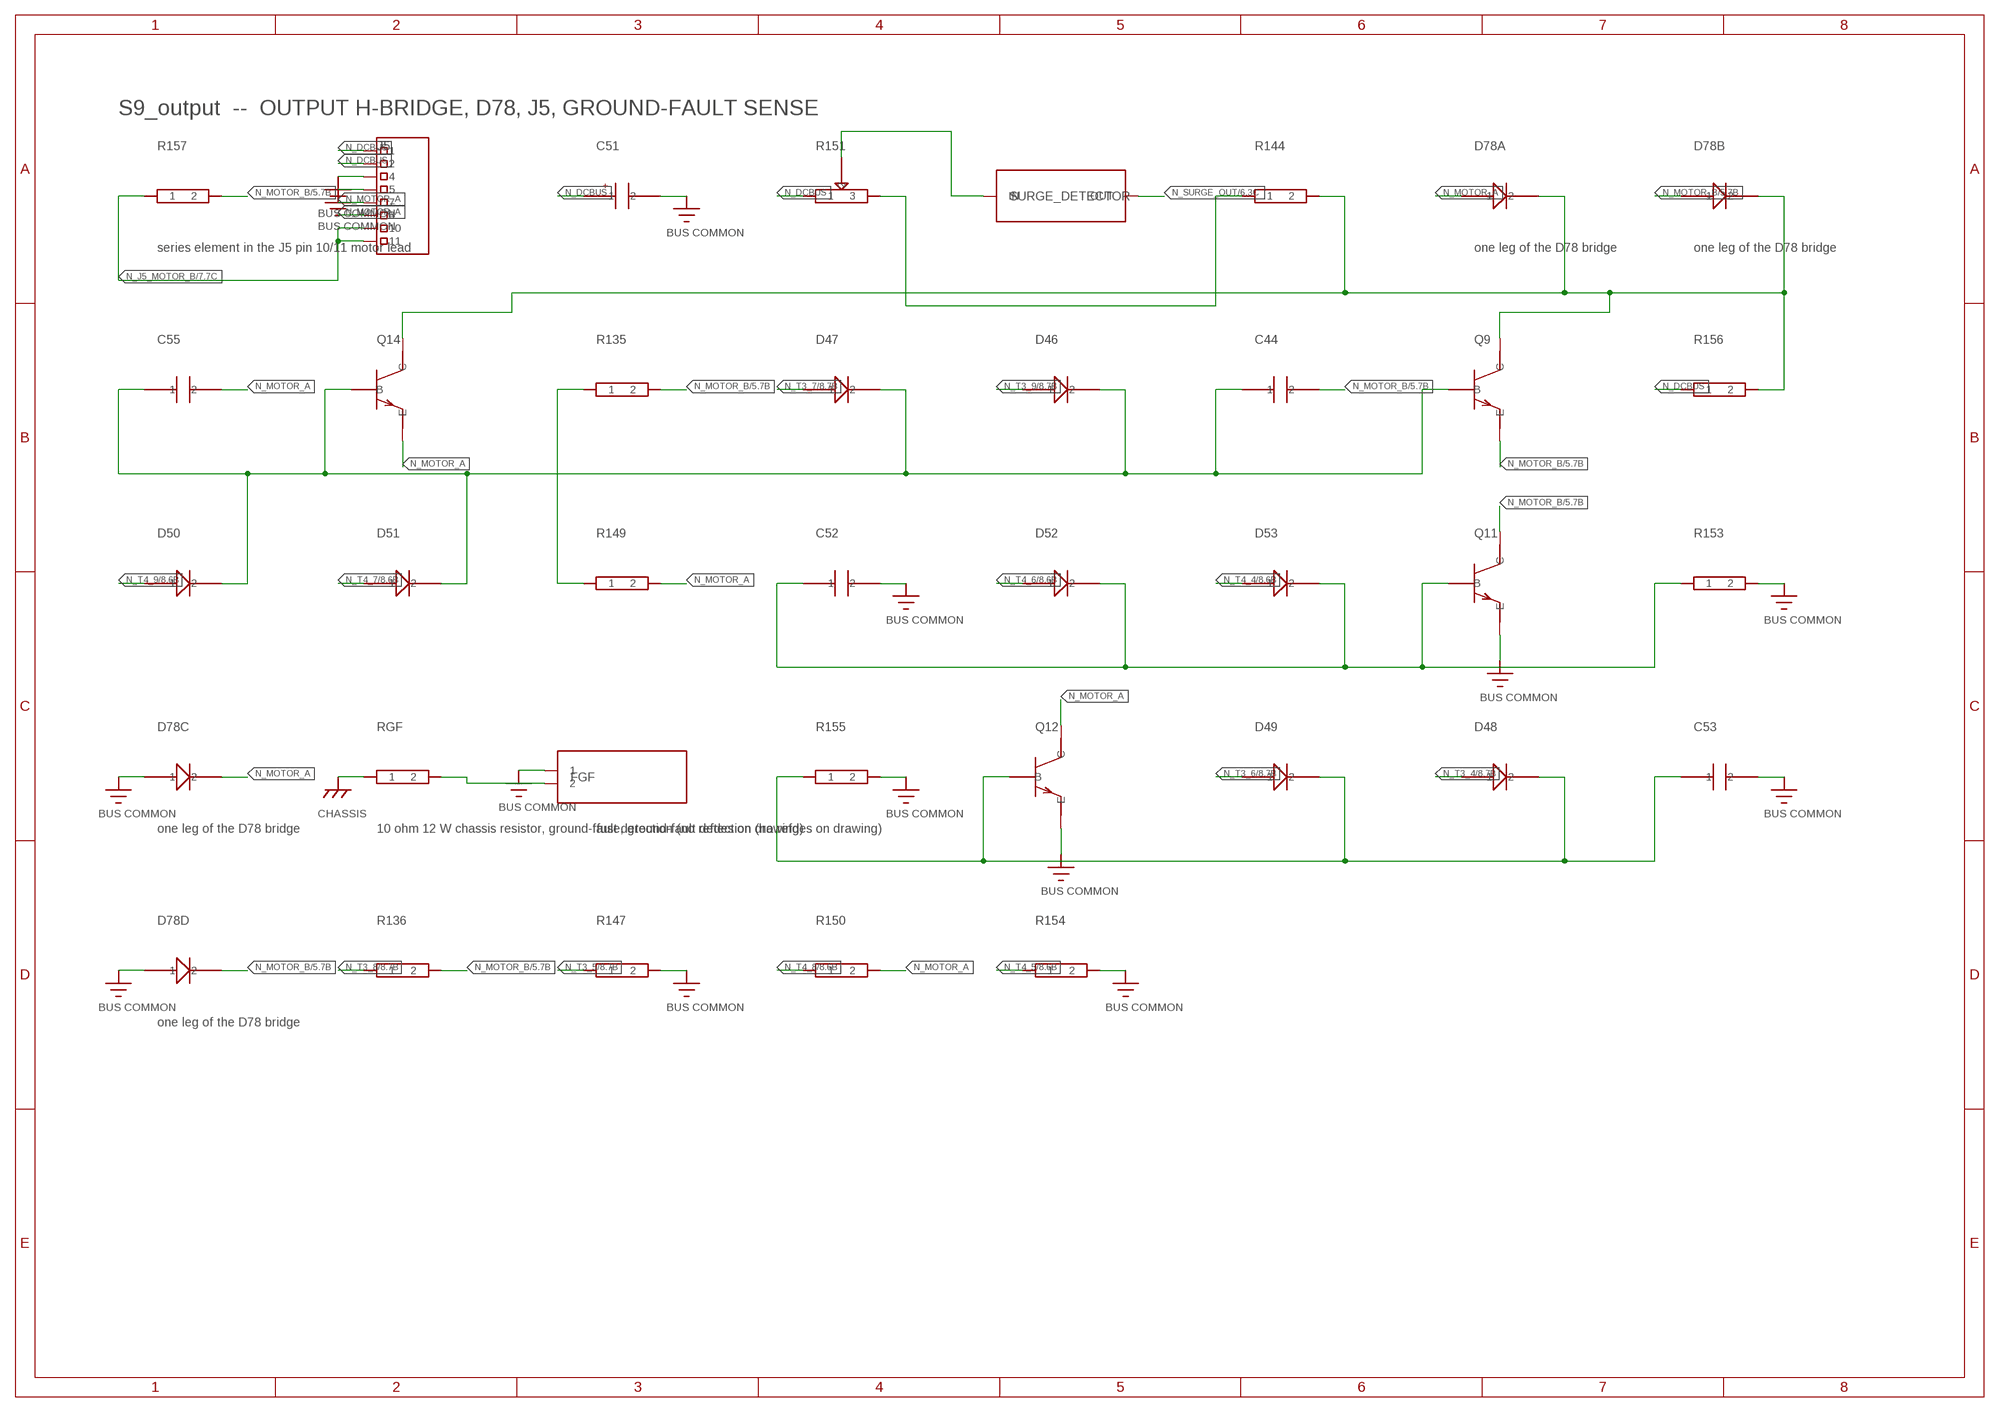
[diagram p8: schematic, sheet 9]

### Parts
C44  DS_C_1  (no package)
C51  DS_CPOL_1  (no package)
C52  DS_C_1  (no package)
C53  DS_C_1  (no package)
C55  DS_C_1  (no package)
D46  DS_D_1  (no package)
D47  DS_D_1  (no package)
D48  DS_D_1  (no package)
D49  DS_D_1  (no package)
D50  DS_D_1  (no package)
D51  DS_D_1  (no package)
D52  DS_D_1  (no package)
D53  DS_D_1  (no package)
D78A  one leg of the D78 bridge  DS_D_1  (no package)
D78B  one leg of the D78 bridge  DS_D_1  (no package)
D78C  one leg of the D78 bridge  DS_D_1  (no package)
D78D  one leg of the D78 bridge  DS_D_1  (no package)
FGF  fuse, ground-fault detection (no refdes on drawing)  DS_BLOCK_8  (no package)
J5  DS_CONN_5  (no package)
Q9  DS_NPN_1  (no package)
Q11  DS_NPN_1  (no package)
Q12  DS_NPN_1  (no package)
Q14  DS_NPN_1  (no package)
R135  DS_R_1  (no package)
R136  DS_R_1  (no package)
R144  DS_R_1  (no package)
R147  DS_R_1  (no package)
R149  DS_R_1  (no package)
R150  DS_R_1  (no package)
R151  DS_POT_1  (no package)
R153  DS_R_1  (no package)
R154  DS_R_1  (no package)
R155  DS_R_1  (no package)
R156  DS_R_1  (no package)
R157  series element in the J5 pin 10/11 motor lead  DS_R_1  (no package)
RGF  10 ohm 12 W chassis resistor, ground-fault detection (no refdes on drawing)  DS_R_1  (no package)
SURGE_DETECTOR  DS_BLOCK_7  (no package)

### Nets
BUSCOM: C51.2 C52.2 C53.2 D78C.1 D78D.1 FGF.1 J5.4 J5.5 Q11.E Q12.E R147.2 R153.2 R154.2 R155.2 ; supply symbol labelled SUPPLY_BUSCOM ; also sheet 7
CHASSIS: RGF.1 ; supply symbol labelled SUPPLY_CHASSIS ; also sheet 1
N_DCBUS: C51.1 J5.1 J5.2 R151.1 R156.1
N_DCBUS_SW: D78A.2 D78B.2 Q9.C Q14.C R144.2 R156.2
N_GF_MID: FGF.2 RGF.2
N_J5_MOTOR_B: J5.10 J5.11 R157.1 ; also sheet 7
N_MOTOR_A: C55.2 D78A.1 D78C.2 J5.7 J5.8 Q12.C Q14.E R149.2 R150.2
N_MOTOR_B: C44.2 D78B.1 D78D.2 Q9.E Q11.C R135.2 R136.2 R157.2 ; also sheet 5,7
N_Q9_B: C44.1 D46.2 D47.2 Q9.B R135.1
N_Q11_B: C52.1 D52.2 D53.2 Q11.B R153.1
N_Q12_B: C53.1 D48.2 D49.2 Q12.B R155.1
N_Q14_B: C55.1 D50.2 D51.2 Q14.B R149.1
N_R144_R151: R144.1 R151.3
N_R151TAP: R151.2 SURGE_DETECTOR.IN
N_SURGE_OUT: SURGE_DETECTOR.OUT ; also sheet 6
N_T3_4: D48.1 ; also sheet 8
N_T3_5: R147.1 ; also sheet 8
N_T3_6: D49.1 ; also sheet 8
N_T3_7: D47.1 ; also sheet 8
N_T3_8: R136.1 ; also sheet 8
N_T3_9: D46.1 ; also sheet 8
N_T4_4: D53.1 ; also sheet 8
N_T4_5: R154.1 ; also sheet 8
N_T4_6: D52.1 ; also sheet 8
N_T4_7: D51.1 ; also sheet 8
N_T4_8: R150.1 ; also sheet 8
N_T4_9: D50.1 ; also sheet 8

### Notes on the sheet
- S9_output  --  OUTPUT H-BRIDGE, D78, J5, GROUND-FAULT SENSE

## Library data of the parts
C1-C5 C10-C12 C16-C18 C20-C23 C27 C30 C31 C36-C41 C43 C44 C52 C53 C55 = sd1525:DS_C_1: C
C6-C9 C42 C50 C51 C56 C61 = sd1525:DS_CPOL_1: CPOL
CLOCK = sd1525:DS_BLOCK_4: BLOCK
D1-D3 D5-D8 D12-D19 D24 D25 D36-D43 D46-D53 D78A D78B D78C D78D = sd1525:DS_D_1: D
D9-D11 D12A D44 = sd1525:DS_ZENER_1: ZENER
DRIVER1 DRIVER2 = sd1525:DS_BLOCK_6: BLOCK
FGF = sd1525:DS_BLOCK_8: BLOCK
J1 = sd1525:DS_CONN_1: CONN
J2 = sd1525:DS_CONN_2: CONN
J3 = sd1525:DS_CONN_3: CONN
J4 = sd1525:DS_CONN_4: CONN
J5 = sd1525:DS_CONN_5: CONN
JMP1 = sd1525:DS_JUMPER_1: JUMPER
LED1-LED4 = sd1525:DS_LED_1: LED
LOCKOUT = sd1525:DS_BLOCK_5: BLOCK
PWM = sd1525:DS_BLOCK_3: BLOCK
Q1 = sd1525:DS_JFET_1: JFET
Q2 Q9 Q11 Q12 Q14 = sd1525:DS_NPN_1: NPN
Q5 = sd1525:DS_PNP_1: PNP
Q6 Q7 = sd1525:DS_NMOS_1: NMOS
R1-R11 R12A R13-R16 R19-R21 R33-R35 R35B R36-R43 R45-R54 R56-R59 R59B R60 R60B R64A R64B R65-R69 R73 R76 R78A R78B R79 R80A R80B R81-R91 R94 R95 R99 R100 R102-R104 R113-R117 R120-R126 R130-R137 R142 R144 R147 R149 R150 R153-R157 RGF = sd1525:DS_R_1: R
R12B R44 = sd1525:DS_POT_2: POT
R27-R29 R31 R151 = sd1525:DS_POT_1: POT
R30 R32 = sd1525:DS_POT_3: POT
R118 R119 = sd1525:DS_POT_4: POT
RMSTIMER = sd1525:DS_BLOCK_1: BLOCK
S1 = sd1525:DS_JUMPER_2: JUMPER
SURGE_DETECTOR = sd1525:DS_BLOCK_7: BLOCK
T1 = sd1525:DS_XFMR_1: XFMR
T2 = sd1525:DS_XFMR_2: XFMR
T3 T4 = sd1525:DS_XFMR_3: XFMR
TEMPSENSOR = sd1525:DS_BLOCK_2: BLOCK
TP1-TP7 = sd1525:DS_TP_1: TP
TP8 = sd1525:DS_TP_2: TP
U1A U2A U8A = sd1525:DS_OPAMP_1: OPAMP
U1B U8B = sd1525:DS_OPAMP_2: OPAMP
U2B = sd1525:DS_OPAMP_3: OPAMP
U2C = sd1525:DS_OPAMP_4: OPAMP
U3 = sd1525:DS_COMP_1: COMP
U4A = sd1525:DS_NPN_2: NPN
U4B = sd1525:DS_NPN_3: NPN
U4C = sd1525:DS_NPN_4: NPN
U4D = sd1525:DS_NPN_5: NPN
U5 = sd1525:DS_IC_4: IC
U6 = sd1525:DS_IC_3: IC
U7A = sd1525:DS_IC_1: IC
U7B = sd1525:DS_IC_5: IC
U7C = sd1525:DS_IC_6: IC
U7D = sd1525:DS_IC_2: IC
U9A = sd1525:DS_OPAMP_6: OPAMP
U9B = sd1525:DS_OPAMP_5: OPAMP